# EAGLE design io (EAGLE 9.5.2)

## Sheet 1 of 5: Interface, Address Decoding
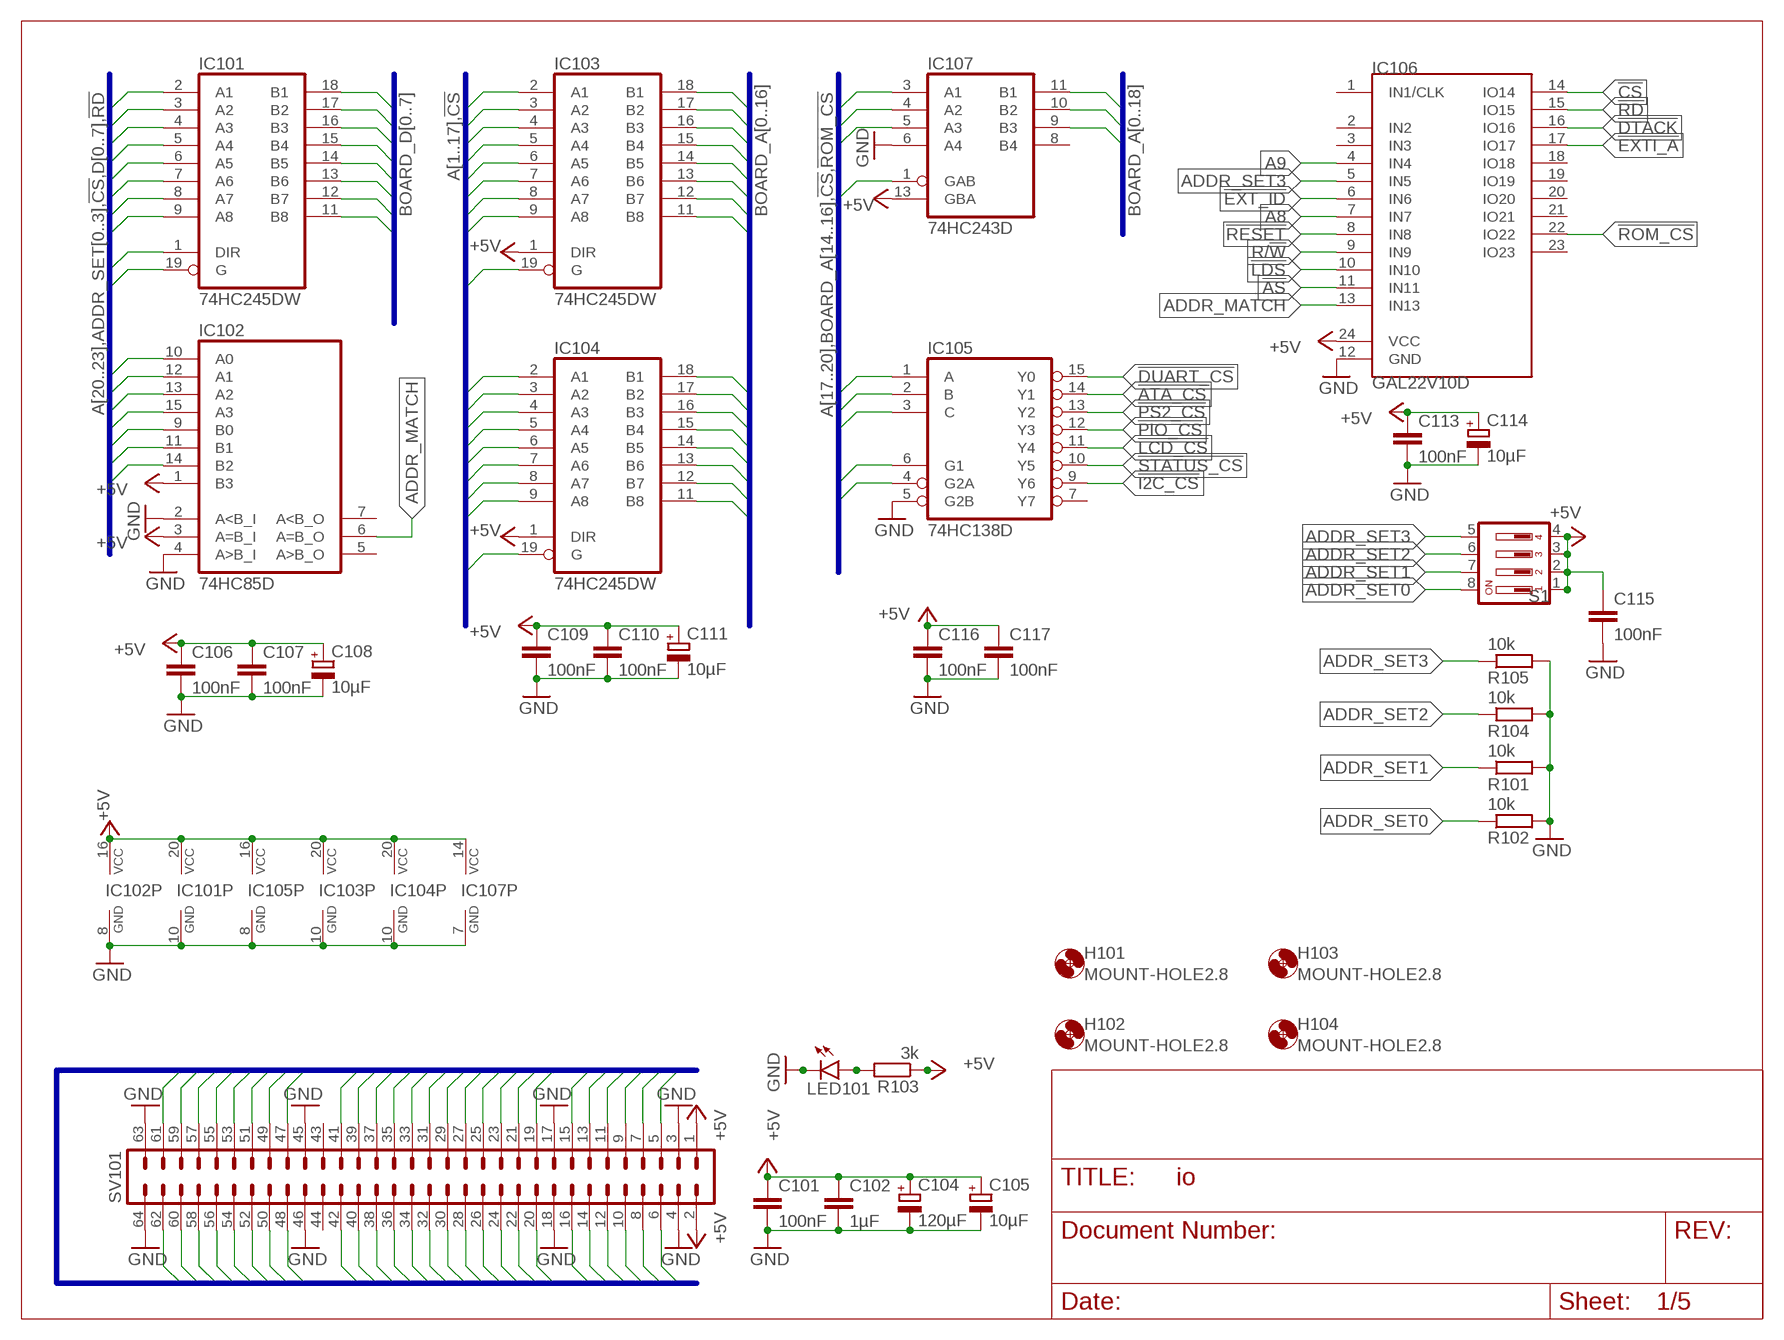
[diagram p0: schematic, sheet 1]

### Parts
C101  100nF  C-EUC0805  [C0805]
C102  1µF  C-EUC0805  [C0805]
C104  120µF  CPOL-EUE2.5-7  [E2,5-7]
C105  10µF  CPOL-EUSMCB  [SMC_B]
C106  100nF  C-EUC0805  [C0805]
C107  100nF  C-EUC0805  [C0805]
C108  10µF  CPOL-EUSMCB  [SMC_B]
C109  100nF  C-EUC0805  [C0805]
C110  100nF  C-EUC0805  [C0805]
C111  10µF  CPOL-EUSMCB  [SMC_B]
C113  100nF  C-EUC0805  [C0805]
C114  10µF  CPOL-EUSMCB  [SMC_B]
C115  100nF  C-EUC0805  [C0805]
C116  100nF  C-EUC0805  [C0805]
C117  100nF  C-EUC0805  [C0805]
H101  MOUNT-HOLE2.8  [2,8]
H102  MOUNT-HOLE2.8  [2,8]
H103  MOUNT-HOLE2.8  [2,8]
H104  MOUNT-HOLE2.8  [2,8]
IC101  74HC245DW  [SO20W]
IC102  74HC85D  [SO16]
IC103  74HC245DW  [SO20W]
IC104  74HC245DW  [SO20W]
IC105  74HC138D  [SO16]
IC106  GAL22V10D  GAL22V10DIP24  [DIL24S]
IC107  74HC243D  [SO14]
LED101  LEDCHIPLED_1206  [CHIPLED_1206]
R101  10k  R-EU_R2012  [R2012]
R102  10k  R-EU_R2012  [R2012]
R103  3k  R-EU_R2012  [R2012]
R104  10k  R-EU_R2012  [R2012]
R105  10k  R-EU_R2012  [R2012]
S1  DP04  [DP-04]
SV101  ML64L  [ML64L]

### Nets
!AS: IC106.11(IN11) SV101.13
!ATA_CS: IC105.14(Y1)
!BG: SV101.9
!BGACK: SV101.8
!BR: SV101.7
!CS: IC101.19(G) IC103.19(G) IC104.19(G) IC105.4(G2A) IC106.14(IO14) IC107.1(GAB)
!DTACK: IC106.16(IO16) SV101.10 ; also sheet 3
!DUART_CS: IC105.15(Y0) ; also sheet 3
!EXT_ID: IC106.6(IN6) SV101.41
!EXTI_A: IC106.17(IO17) SV101.16
!EXTI_B: SV101.15
!HALT: SV101.5
!I2C_CS: IC105.9(Y6)
!LCD_CS: IC105.11(Y4)
!LDS: IC106.10(IN10) SV101.11
!PIO_CS: IC105.12(Y3)
!PS2_CS: IC105.13(Y2) ; also sheet 5
!RD: IC101.1(DIR) IC106.15(IO15) ; also sheet 2,5
!RESET: IC106.8(IN8) SV101.6 ; also sheet 3
!ROM_CS: IC105.6(G1) IC106.22(IO22) ; also sheet 2
!STATUS_CS: IC105.10(Y5)
!UDS: SV101.14
+5V: C101.1 C102.1 C104.+ C105.+ C106.1 C107.1 C108.+ C109.1 C110.1 C111.+ C113.1 C114.+ C115.1 C116.1 C117.1 IC101.20(VCC) IC102.1(B3) IC102.3(A=B_I) IC102.16(VCC) IC103.1(DIR) IC103.20(VCC) IC104.1(DIR) IC104.20(VCC) IC105.16(VCC) IC106.24(VCC) IC107.13(GBA) IC107.14(VCC) R103.1 S1.1 S1.2 S1.3 S1.4 SV101.1 SV101.2 ; also sheet 2,3,5
A1: IC103.2(A1) SV101.20
A2: IC103.3(A2) SV101.22
A3: IC103.4(A3) SV101.19
A4: IC103.5(A4) SV101.24
A5: IC103.6(A5) SV101.21
A6: IC103.7(A6) SV101.23
A7: IC103.8(A7) SV101.26
A8: IC103.9(A8) IC106.7(IN7) SV101.25
A9: IC104.2(A1) IC106.4(IN4) SV101.28
A10: IC104.3(A2) SV101.27
A11: IC104.4(A3) SV101.30
A12: IC104.5(A4) SV101.29
A13: IC104.6(A5) SV101.31
A14: IC104.7(A6) SV101.32
A15: IC104.8(A7) SV101.33
A16: IC104.9(A8) SV101.34
A17: IC107.3(A1) SV101.36
A18: IC107.4(A2) SV101.35
A19: IC107.5(A3) SV101.38
A20: IC102.10(A0) SV101.37
A21: IC102.12(A1) SV101.40
A22: IC102.13(A2) SV101.39
A23: IC102.15(A3) SV101.42
ADDR_MATCH: IC102.6(A=B_O) IC106.13(IN13)
ADDR_SET0: IC102.9(B0) R102.1 S1.8
ADDR_SET1: IC102.11(B1) R101.1 S1.7
ADDR_SET2: IC102.14(B2) R104.1 S1.6
ADDR_SET3: IC106.5(IN5) R105.1 S1.5
BOARD_A0: IC103.18(B1) ; also sheet 2,3
BOARD_A1: IC103.17(B2) ; also sheet 2,3
BOARD_A2: IC103.16(B3) ; also sheet 2,3
BOARD_A3: IC103.15(B4) ; also sheet 2,3
BOARD_A4: IC103.14(B5) ; also sheet 2
BOARD_A5: IC103.13(B6) ; also sheet 2
BOARD_A6: IC103.12(B7) ; also sheet 2
BOARD_A7: IC103.11(B8) ; also sheet 2
BOARD_A8: IC104.18(B1) ; also sheet 2
BOARD_A9: IC104.17(B2) ; also sheet 2
BOARD_A10: IC104.16(B3) ; also sheet 2
BOARD_A11: IC104.15(B4) ; also sheet 2
BOARD_A12: IC104.14(B5) ; also sheet 2
BOARD_A13: IC104.13(B6) ; also sheet 2
BOARD_A14: IC104.12(B7) IC105.1(A) ; also sheet 2
BOARD_A15: IC104.11(B8) IC105.2(B) ; also sheet 2
BOARD_A16: IC105.3(C) IC107.11(B1)
BOARD_A17: IC107.10(B2)
BOARD_A18: IC107.9(B3)
BOARD_D0: IC101.18(B1) ; also sheet 3
BOARD_D1: IC101.17(B2) ; also sheet 3
BOARD_D2: IC101.16(B3) ; also sheet 3
BOARD_D3: IC101.15(B4) ; also sheet 3
BOARD_D4: IC101.14(B5) ; also sheet 3
BOARD_D5: IC101.13(B6) ; also sheet 3
BOARD_D6: IC101.12(B7) ; also sheet 3
BOARD_D7: IC101.11(B8) ; also sheet 3
D0: IC101.2(A1) SV101.62
D1: IC101.3(A2) SV101.60
D2: IC101.4(A3) SV101.58
D3: IC101.5(A4) SV101.56
D4: IC101.6(A5) SV101.54
D5: IC101.7(A6) SV101.52
D6: IC101.8(A7) SV101.50
D7: IC101.9(A8) SV101.48
D8: SV101.57
D9: SV101.59
D10: SV101.61
D11: SV101.55
D12: SV101.53
D13: SV101.51
D14: SV101.49
D15: SV101.47
GND: C101.2 C102.2 C104.- C105.- C106.2 C107.2 C108.- C109.2 C110.2 C111.- C113.2 C114.- C115.2 C116.2 C117.2 IC101.10(GND) IC102.2(A<B_I) IC102.4(A>B_I) IC102.8(GND) IC103.10(GND) IC104.10(GND) IC105.5(G2B) IC105.8(GND) IC106.12(GND) IC107.6(A4) IC107.7(GND) LED101.C R101.2 R102.2 R104.2 R105.2 SV101.3 SV101.4 SV101.17 SV101.18 SV101.45 SV101.46 SV101.63 SV101.64 ; also sheet 2,3,5
N$18: LED101.A R103.2
R/!W!: IC106.9(IN9) SV101.12 ; also sheet 2,5
Unconnected: IC102.5(A>B_O) IC102.7(A<B_O) IC105.7(Y7) IC106.1(IN1/CLK) IC106.2(IN2) IC106.3(IN3) IC106.18(IO18) IC106.19(IO19) IC106.20(IO20) IC106.21(IO21) IC106.23(IO23) IC107.8(B4) SV101.43 SV101.44

### Buses
A[1..23],!BERR,!BG,!BGACK,!BR,CLK,D[0..15],!DTACK,E,!EXTI_A,!EXTI_B,!EXT_ID,FC[0..2],!HALT,!IPL[0..2],!RESET,R/!W!,!VMA,!VPA
A[20..23],ADDR_SET[0..3],!CS,D[0..7],!RD
BOARD_A[0..18]
A[17..20],BOARD_A[14..16],!CS,!ROM_CS
BOARD_D[0..7]
A[1..17],!CS
BOARD_A[0..16]

## Sheet 2 of 5: Card ID
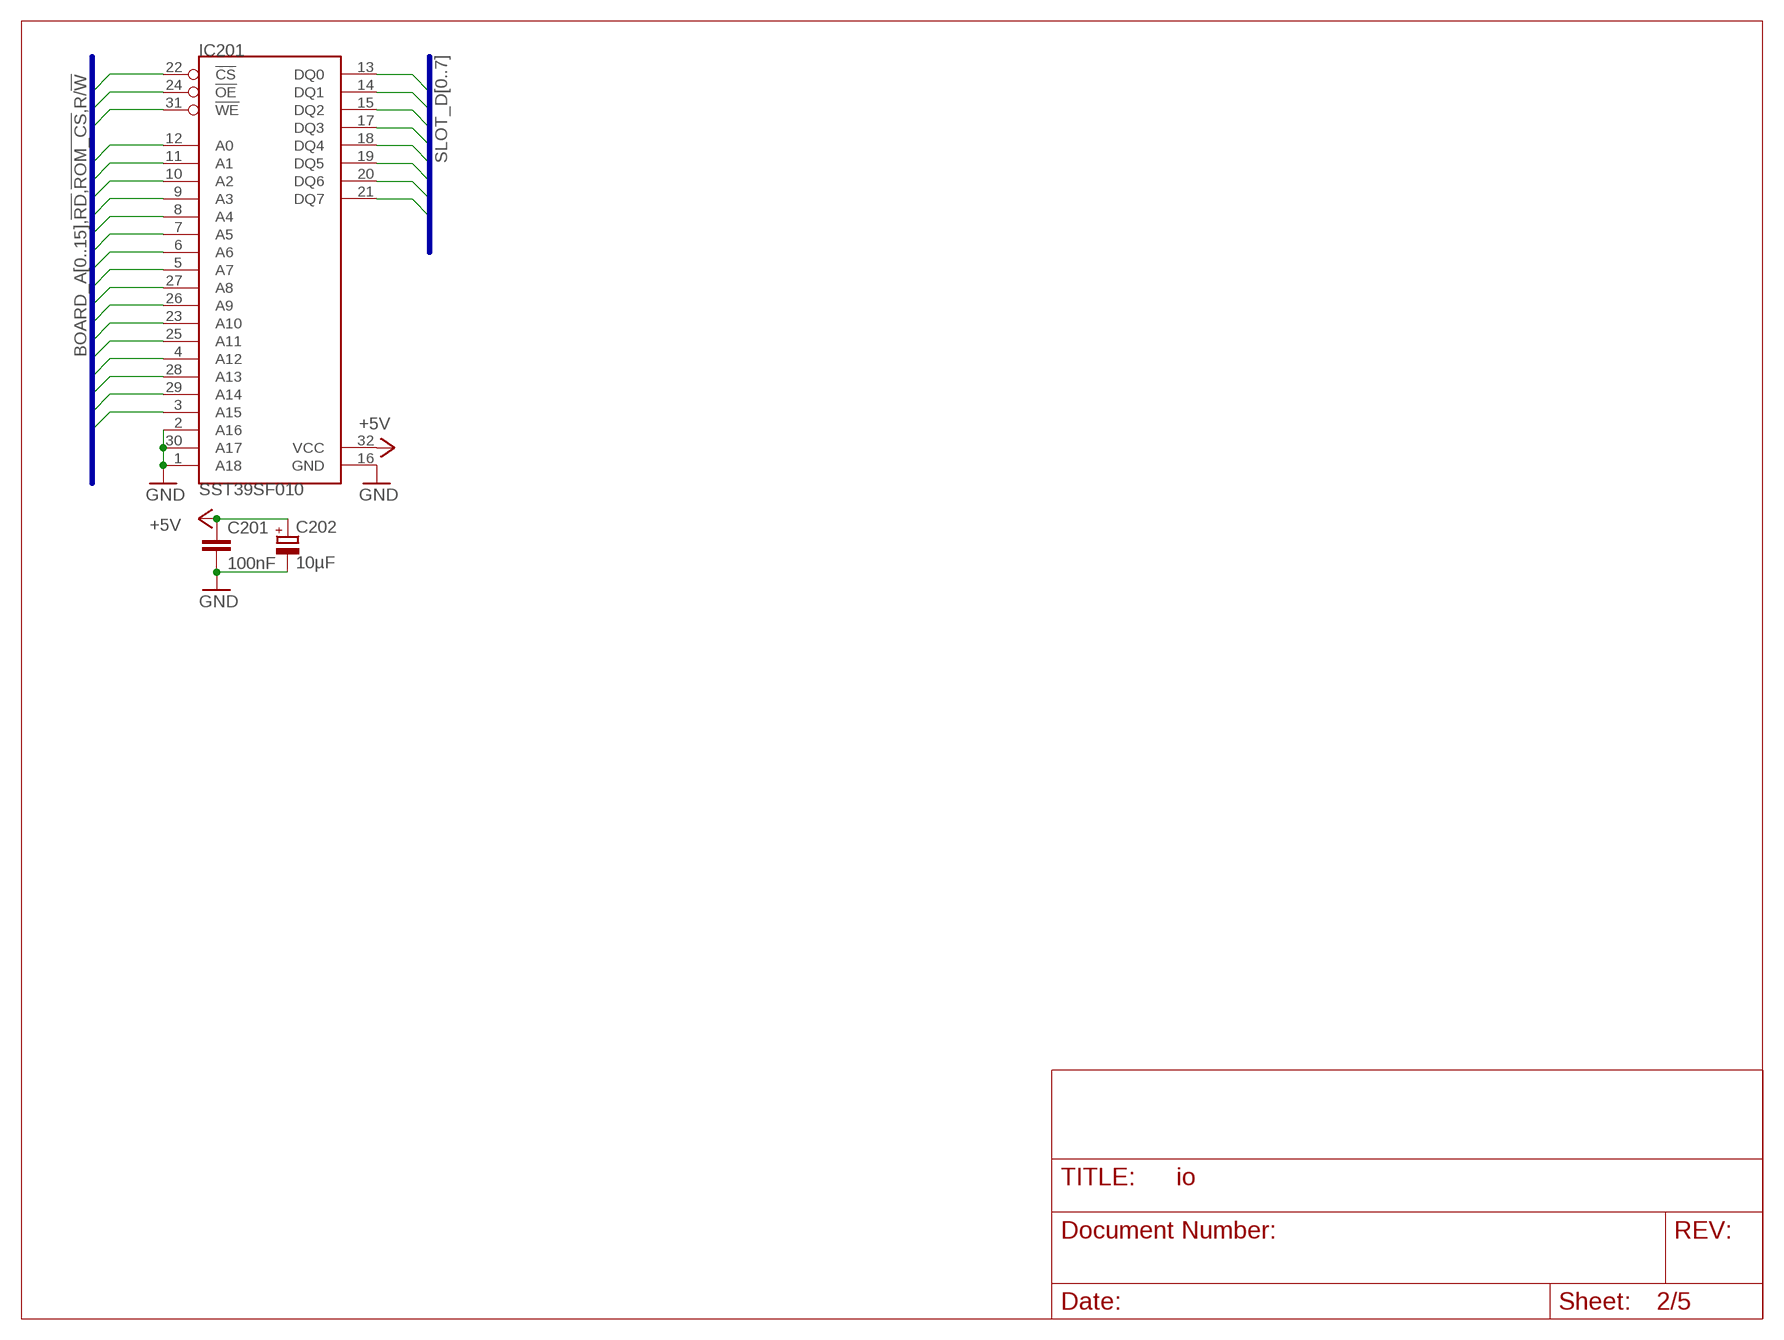
[diagram p1: schematic, sheet 2]

### Parts
C201  100nF  C-EUC0805  [C0805]
C202  10µF  CPOL-EUSMCB  [SMC_B]
IC201  SST39SF010  SST39SF0X0PLCC32-SOCKET  [PLCC-S32]

### Nets
!RD: IC201.24(!OE) ; also sheet 1,5
!ROM_CS: IC201.22(!CS) ; also sheet 1
+5V: C201.1 C202.+ IC201.32(VCC) ; also sheet 1,3,5
BOARD_A0: IC201.12(A0) ; also sheet 1,3
BOARD_A1: IC201.11(A1) ; also sheet 1,3
BOARD_A2: IC201.10(A2) ; also sheet 1,3
BOARD_A3: IC201.9(A3) ; also sheet 1,3
BOARD_A4: IC201.8(A4) ; also sheet 1
BOARD_A5: IC201.7(A5) ; also sheet 1
BOARD_A6: IC201.6(A6) ; also sheet 1
BOARD_A7: IC201.5(A7) ; also sheet 1
BOARD_A8: IC201.27(A8) ; also sheet 1
BOARD_A9: IC201.26(A9) ; also sheet 1
BOARD_A10: IC201.23(A10) ; also sheet 1
BOARD_A11: IC201.25(A11) ; also sheet 1
BOARD_A12: IC201.4(A12) ; also sheet 1
BOARD_A13: IC201.28(A13) ; also sheet 1
BOARD_A14: IC201.29(A14) ; also sheet 1
BOARD_A15: IC201.3(A15) ; also sheet 1
GND: C201.2 C202.- IC201.1(A18) IC201.2(A16) IC201.16(GND) IC201.30(A17) ; also sheet 1,3,5
R/!W!: IC201.31(!WE) ; also sheet 1,5
SLOT_D0: IC201.13(DQ0) ; also sheet 5
SLOT_D1: IC201.14(DQ1) ; also sheet 5
SLOT_D2: IC201.15(DQ2) ; also sheet 5
SLOT_D3: IC201.17(DQ3) ; also sheet 5
SLOT_D4: IC201.18(DQ4) ; also sheet 5
SLOT_D5: IC201.19(DQ5) ; also sheet 5
SLOT_D6: IC201.20(DQ6) ; also sheet 5
SLOT_D7: IC201.21(DQ7) ; also sheet 5

### Buses
SLOT_D[0..7]
BOARD_A[0..15],!RD,!ROM_CS,R/!W!

## Sheet 3 of 5: Serial/Parallel IO
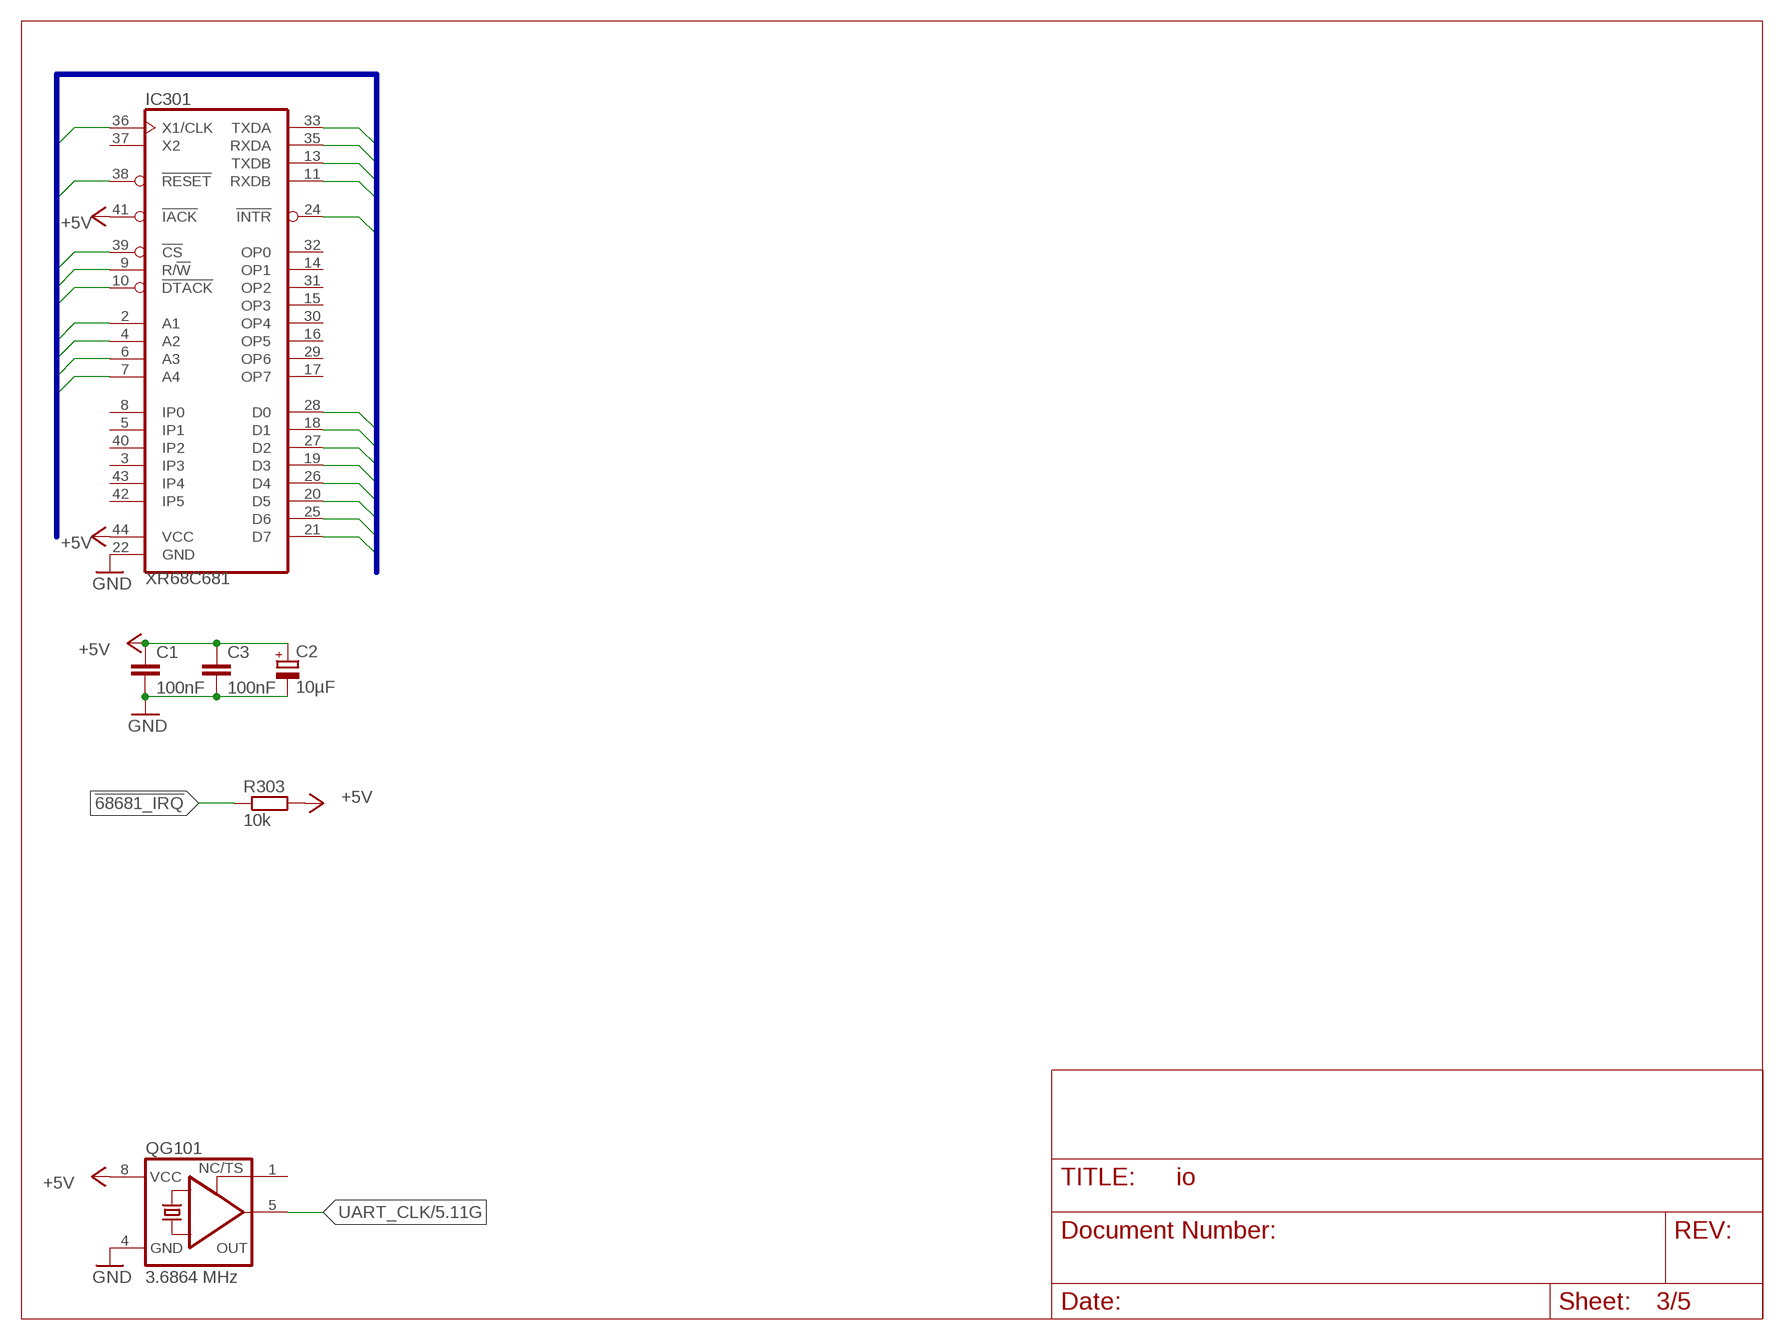
[diagram p2: schematic, sheet 3]

### Parts
C1  100nF  C-EUC0805  [C0805]
C2  10µF  CPOL-EUSMCB  [SMC_B]
C3  100nF  C-EUC0805  [C0805]
IC301  XR68C681  MC68681PLCC44-SOCKET  [PLCC-S44]
QG101  3.6864 MHz  XO-8  [DIL08S]
R303  10k  R-EU_R2012  [R2012]

### Nets
!68681_IRQ: IC301.24(!INTR) R303.1
!DTACK: IC301.10(!DTACK) ; also sheet 1
!DUART_CS: IC301.39(!CS) ; also sheet 1
!LWE: IC301.9(R/!W)
!RESET: IC301.38(!RESET) ; also sheet 1
+5V: C1.1 C2.+ C3.1 IC301.41(!IACK) IC301.44(VCC) QG101.8(VCC) R303.2 ; also sheet 1,2,5
A_RX: IC301.35(RXDA)
A_TX: IC301.33(TXDA)
B_RX: IC301.11(RXDB)
B_TX: IC301.13(TXDB)
BOARD_A0: IC301.2(A1) ; also sheet 1,2
BOARD_A1: IC301.4(A2) ; also sheet 1,2
BOARD_A2: IC301.6(A3) ; also sheet 1,2
BOARD_A3: IC301.7(A4) ; also sheet 1,2
BOARD_D0: IC301.28(D0) ; also sheet 1
BOARD_D1: IC301.18(D1) ; also sheet 1
BOARD_D2: IC301.27(D2) ; also sheet 1
BOARD_D3: IC301.19(D3) ; also sheet 1
BOARD_D4: IC301.26(D4) ; also sheet 1
BOARD_D5: IC301.20(D5) ; also sheet 1
BOARD_D6: IC301.25(D6) ; also sheet 1
BOARD_D7: IC301.21(D7) ; also sheet 1
GND: C1.2 C2.- C3.2 IC301.22(GND) QG101.4(GND) ; also sheet 1,2,5
UART_CLK: IC301.36(X1/CLK) QG101.5(OUT) ; also sheet 5
Unconnected: IC301.3(IP3) IC301.5(IP1) IC301.8(IP0) IC301.14(OP1) IC301.15(OP3) IC301.16(OP5) IC301.17(OP7) IC301.29(OP6) IC301.30(OP4) IC301.31(OP2) IC301.32(OP0) IC301.37(X2) IC301.40(IP2) IC301.42(IP5) IC301.43(IP4) QG101.1(TS)

### Buses
!68681_IRQ,A_RX,A_TX,BOARD_A[0..4],BOARD_D[0..7],B_RX,B_TX,!DTACK,!DUART_CS,!LWE,!RESET,UART_CLK

## Sheet 4 of 5: IDE Interface
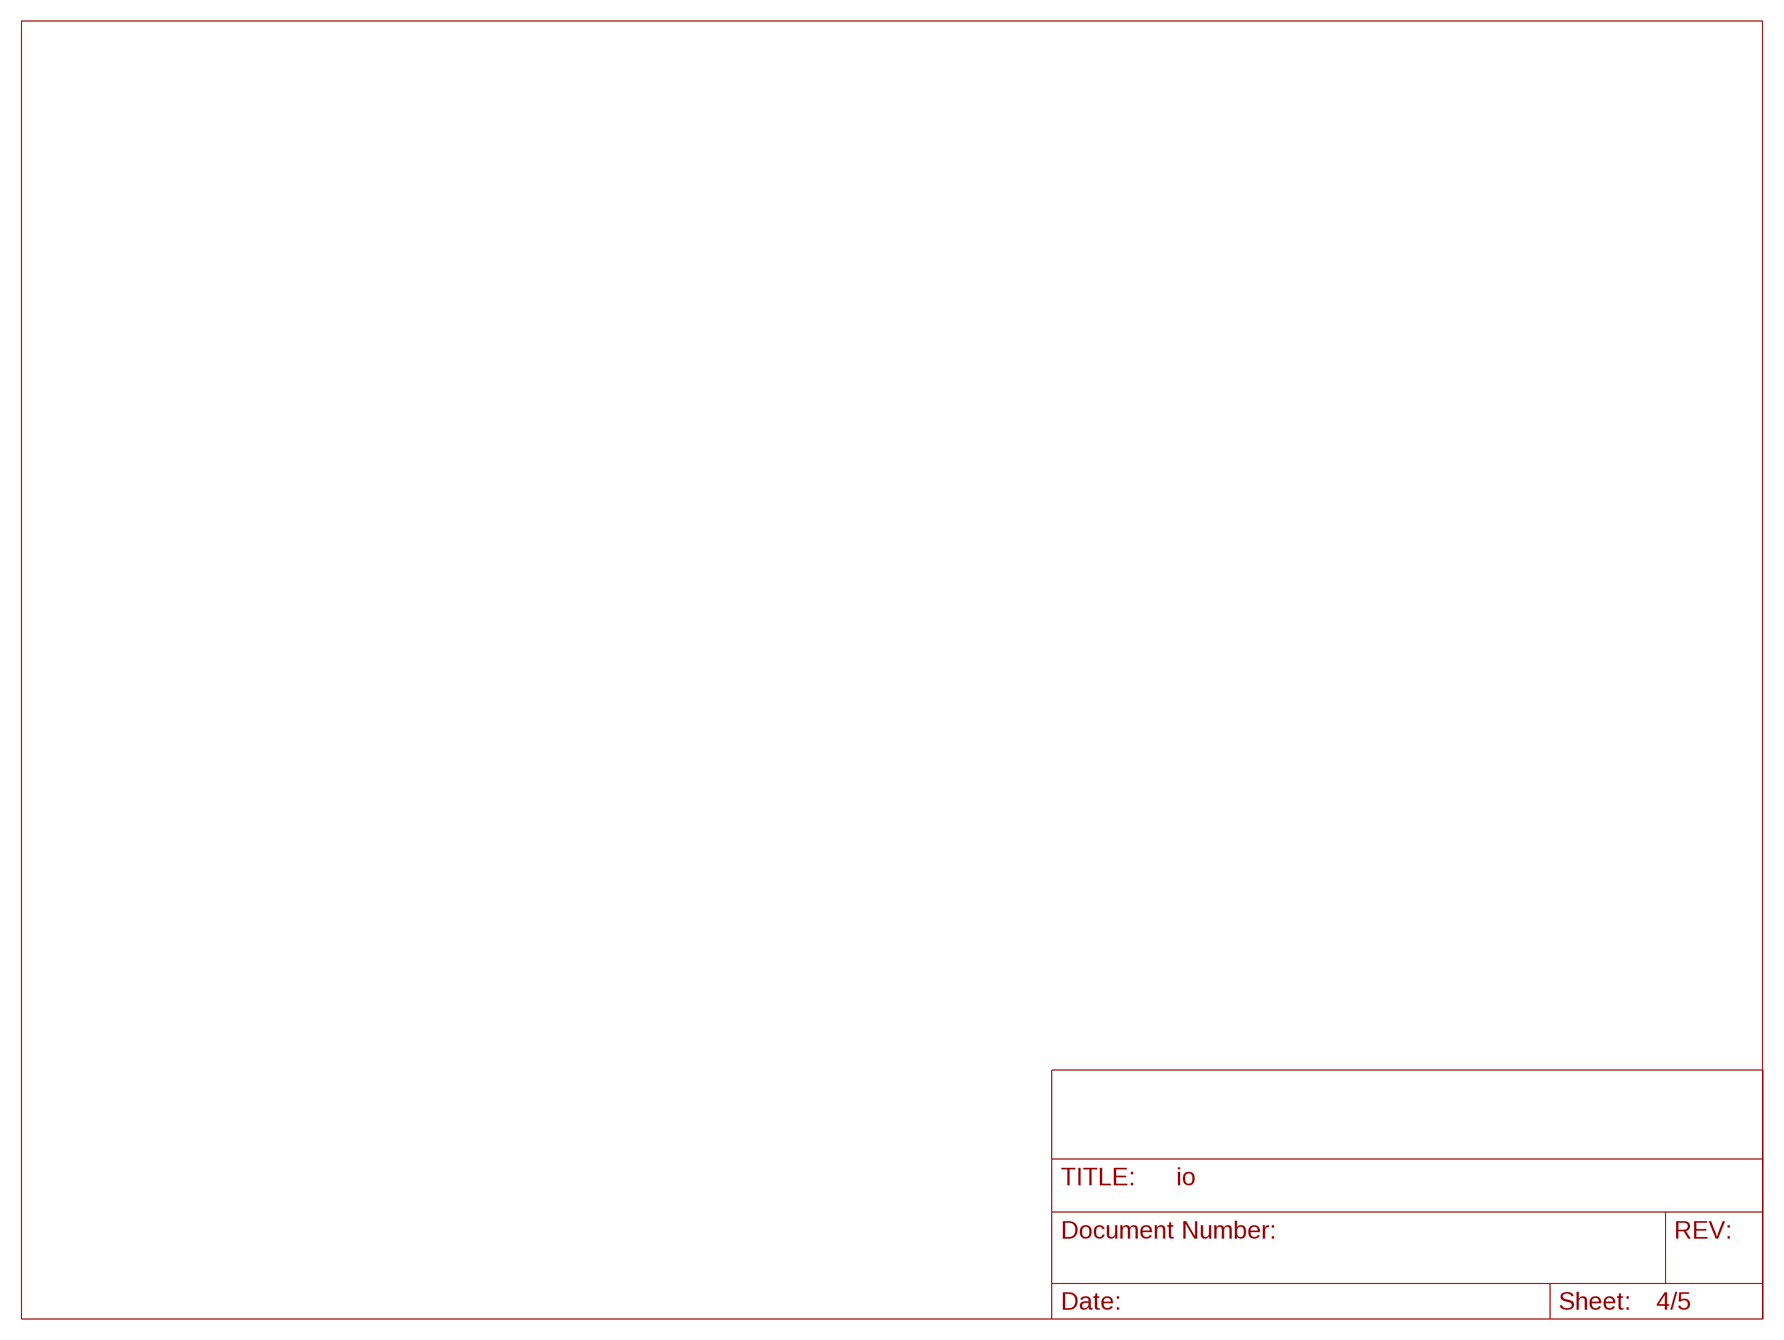
[diagram p3: schematic, sheet 4]

## Sheet 5 of 5: PS/2 Keyboard/Mouse
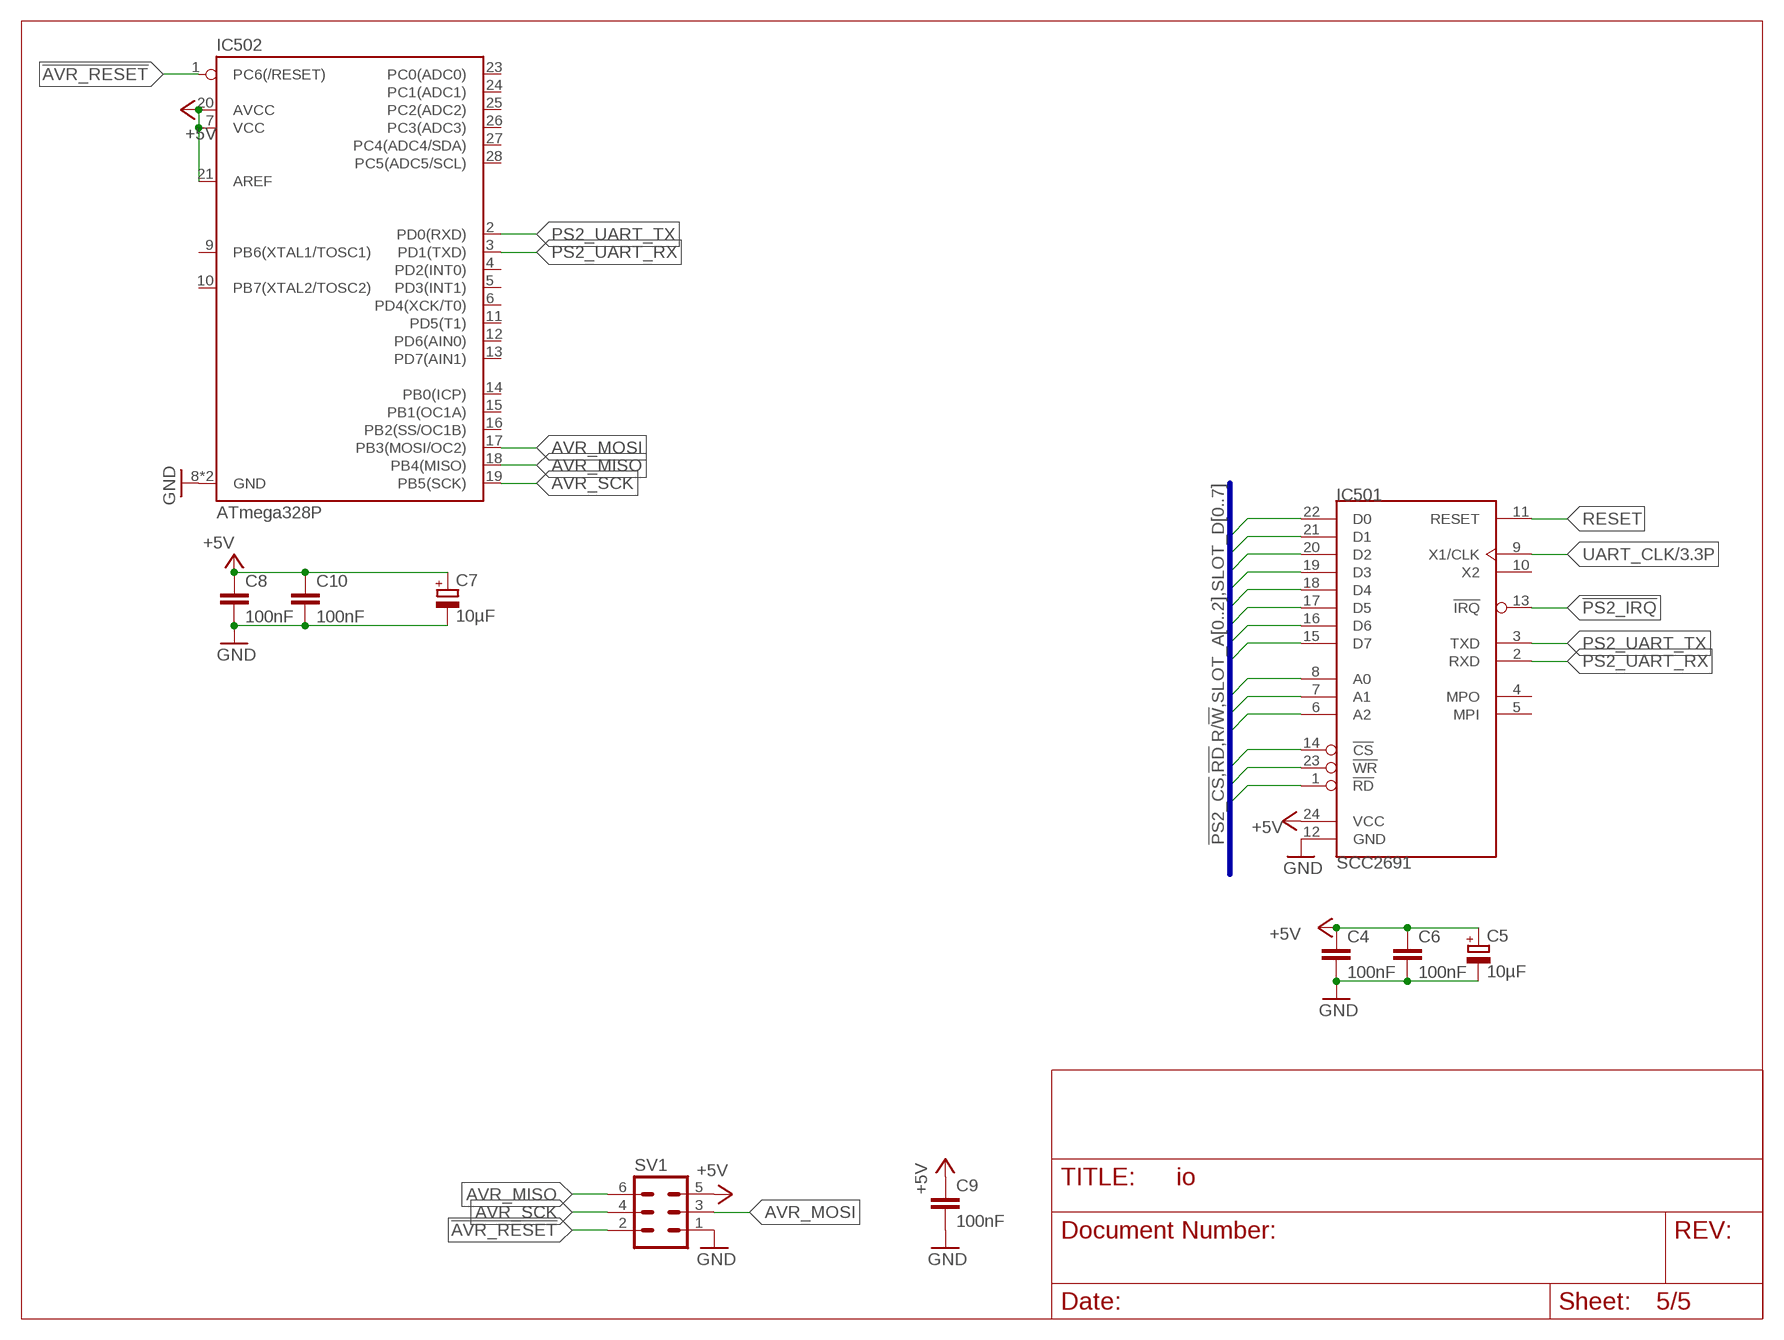
[diagram p4: schematic, sheet 5]

### Parts
C4  100nF  C-EUC0805  [C0805]
C5  10µF  CPOL-EUSMCB  [SMC_B]
C6  100nF  C-EUC0805  [C0805]
C7  10µF  CPOL-EUSMCB  [SMC_B]
C8  100nF  C-EUC0805  [C0805]
C9  100nF  C-EUC0805  [C0805]
C10  100nF  C-EUC0805  [C0805]
IC501  SCC2691  [DIL24S]
IC502  ATmega328P  ATMEGA328P_PDIP  [DIP28]
SV1  ML6  [ML6]

### Nets
!AVR_RESET: IC502.1(PC6(/RESET)) SV1.2
!PS2_CS: IC501.14(!CS) ; also sheet 1
!PS2_IRQ: IC501.13(!IRQ)
!RD: IC501.1(!RD) ; also sheet 1,2
+5V: C4.1 C5.+ C6.1 C7.+ C8.1 C9.1 C10.1 IC501.24(VCC) IC502.7(VCC) IC502.20(AVCC) IC502.21(AREF) SV1.5 ; also sheet 1,2,3
AVR_MISO: IC502.18(PB4(MISO)) SV1.6
AVR_MOSI: IC502.17(PB3(MOSI/OC2)) SV1.3
AVR_SCK: IC502.19(PB5(SCK)) SV1.4
GND: C4.2 C5.- C6.2 C7.- C8.2 C9.2 C10.2 IC501.12(GND) IC502.8(GND) IC502.22(GND) SV1.1 ; also sheet 1,2,3
PS2_UART_RX: IC501.2(RXD) IC502.3(PD1(TXD))
PS2_UART_TX: IC501.3(TXD) IC502.2(PD0(RXD))
R/!W!: IC501.23(!WR) ; also sheet 1,2
RESET: IC501.11(RESET)
SLOT_A0: IC501.8(A0)
SLOT_A1: IC501.7(A1)
SLOT_A2: IC501.6(A2)
SLOT_D0: IC501.22(D0) ; also sheet 2
SLOT_D1: IC501.21(D1) ; also sheet 2
SLOT_D2: IC501.20(D2) ; also sheet 2
SLOT_D3: IC501.19(D3) ; also sheet 2
SLOT_D4: IC501.18(D4) ; also sheet 2
SLOT_D5: IC501.17(D5) ; also sheet 2
SLOT_D6: IC501.16(D6) ; also sheet 2
SLOT_D7: IC501.15(D7) ; also sheet 2
UART_CLK: IC501.9(X1/CLK) ; also sheet 3
Unconnected: IC501.4(MPO) IC501.5(MPI) IC501.10(X2) IC502.4(PD2(INT0)) IC502.5(PD3(INT1)) IC502.6(PD4(XCK/T0)) IC502.9(PB6(XTAL1/TOSC1)) IC502.10(PB7(XTAL2/TOSC2)) IC502.11(PD5(T1)) IC502.12(PD6(AIN0)) IC502.13(PD7(AIN1)) IC502.14(PB0(ICP)) IC502.15(PB1(OC1A)) IC502.16(PB2(SS/OC1B)) IC502.23(PC0(ADC0)) IC502.24(PC1(ADC1)) IC502.25(PC2(ADC2)) IC502.26(PC3(ADC3)) IC502.27(PC4(ADC4/SDA)) IC502.28(PC5(ADC5/SCL))

### Buses
!PS2_CS,!RD,R/!W!,SLOT_A[0..2],SLOT_D[0..7]

## Library data of the parts
C1 C3 C4 C6 C8-C10 C101 C106 C107 C109 C110 C113 C115-C117 C201 = rcl:C-EU: CAPACITOR, European symbol; MOUSER: 710-885012207072; SPICEPREFIX: C
C2 C5 C7 C105 C108 C111 C114 C202 = rcl:CPOL-EU: POLARIZED CAPACITOR, European symbol; MOUSER: 581-TAJB106K020RNJV; SPICEPREFIX: C
C102 = rcl:C-EU: CAPACITOR, European symbol; MOUSER: 710-885012207078; SPICEPREFIX: C
C104 = rcl:CPOL-EU: POLARIZED CAPACITOR, European symbol; MOUSER: 710-860020373007; SPICEPREFIX: C
H101-H104 = holes:MOUNT-HOLE: MOUNTING HOLE with drill center marker
IC101 IC103 IC104 = 74xx-eu:74*245: Octal BUS TRANSCEIVER, 3-state; MOUSER: 595-SN74HC245DWR
IC102 = 74xx-eu:74*85: 4-bit magnitude COMPARATOR; MOUSER: 771-74HC138D
IC105 = 74xx-eu:74*138: 3-line to 8-line DECODER/DEMULTIPLEXER; MOUSER: 771-74HC138D
IC106 = 68komputer:GAL22V10: GAL22V10D – Generic Array Logic Datasheet <http://web.mit.edu/6.115/www/document/gal22v10.pdf>; MOUSER_SOCKET: 575-1104732441001000
IC107 = 74xx-eu:74*243: Quadruple BUS TRANSCEIVER; MOUSER: 595-CD74HC243M96
IC201 = 68komputer:SST39SF0X0: 1 Mbit / 2 Mbit / 4 Mbit Multi-Purpose Flash Datasheet <http://ww1.microchip.com/downloads/en/DeviceDoc/20005022C.pdf>; MOUSER: 579-SST3910A554INHET; MOUSER_SOCKET: 437-5408803224008
IC301 = 68komputer:MC68681: MC68681 Dual UART Datasheet <https://www.nxp.com/docs/en/data-sheet/SCC68681.pdf>; MOUSER: 701-XR68C681CJ-F; MOUSER_SOCKET: 940-44-044-24-000000
IC501 = 68komputer:SCC2691: SCC2691 – Universal asynchronous receiver/transmitter (UART) Datasheet <https://www.nxp.com/docs/en/data-sheet/SCC2691.pdf>; MOUSER_SOCKET: 575-1104732441001000
IC502 = SparkFun-IC-Microcontroller:ATMEGA328P_PDIP: Atmel 328P Through hole ATMEGA328P uC used in the Arduino 32kb flash, 1k EEPROM, 2k SRAM Datasheet <http://www.sparkfun.com/datasheets/Components/SMD/ATMega328.pdf> SparkFun Products Storefront component: AVR 28 Pin 20MHz 32K 6A/D - ATMega328P <https://www.sparkfun.com/products/9061> (COM-09061) SparkFun Simon Says - Through-Hole Soldering Kit <https://www.sparkfun.com/products/10547> (KIT-10547) SparkFun Learn to Solder - Simon Says <https://www.sparkfun.com/products/13708> (KIT-13708) SparkFun BigTime Watch Kit <https://www.sparkfun.com/products/11734> (KIT-11734) SparkFun ClockIt <https://www.sparkfun.com/products/10930> (KIT-10930) SparkFun Serial Enabled LCD Kit <https://www.sparkfun.com/products/10097> (LCD-10097) SparkFun Simon Tilts - Through Hole Soldering Kit <https://www.sparkfun.com/products/12634> (KIT-12634) SparkFun Frequency Counter Kit <https://www.sparkfun.com/products/10140> (KIT-10140) FabFM Radio Kit <https://www.sparkfun.com/products/11043> (KIT-11043) SparkFun Binary Blaster Kit <https://www.sparkfun.com/products/12037> (KIT-12037) SparkFun Metro-Gnome <https://www.sparkfun.com/products/9236> (KIT-09236) ATmega328 with Arduino Optiboot (Uno) <https://www.sparkfun.com/products/10524> (DEV-10524); MOUSER: 556-ATMEGA328-PU; PROD_ID: IC-09136; VALUE: 328P
LED101 = led:LED: LED OSRAM: - CHIPLED LG R971, LG N971, LY N971, LG Q971, LY Q971, LO R971, LY R971 LH N974, LH R974 LS Q976, LO Q976, LY Q976 LO Q996 - Hyper CHIPLED LW Q18S LB Q993, LB Q99A, LB R99A - SideLED LS A670, LO A670, LY A670, LG A670, LP A670 LB A673, LV A673, LT A673, LW A673 LH A674 LY A675 LS A676, LA A676, LO A676, LY A676, LW A676 LS A679, LY A679, LG A679 - Hyper Micro SIDELED® LS Y876, LA Y876, LO Y876, LY Y876 LT Y87S - SmartLED LW L88C, LW L88S LB L89C, LB L89S, LG L890 LS L89K, LO L89K, LY L89K LS L896, LA L896, LO L896, LY L896 - TOPLED LS T670, LO T670, LY T670, LG T670, LP T670 LSG T670, LSP T670, LSY T670, LOP T670, LYG T670 LG T671, LOG T671, LSG T671 LB T673, LV T673, LT T673, LW T673 LH T674 LS T676, LA T676, LO T676, LY T676, LB T676, LH T676, LSB T676, LW T676 LB T67C, LV T67C, LT T67C, LS T67K, LO T67K, LY T67K, LW E67C LS E67B, LA E67B, LO E67B, LY E67B, LB E67C, LV E67C, LT E67C LW T67C LS T679, LY T679, LG T679 LS T770, LO T770, LY T770, LG T770, LP T770 LB T773, LV T773, LT T773, LW T773 LH T774 LS E675, LA E675, LY E675, LS T675 LS T776, LA T776, LO T776, LY T776, LB T776 LHGB T686 LT T68C, LB T68C - Hyper Mini TOPLED® LB M676 - Mini TOPLED Santana® LG M470 LS M47K, LO M47K, LY M47K Source: http://www.osram.convergy.de LUXEON: - LUMILED® LXK2-PW12-R00, LXK2-PW12-S00, LXK2-PW14-U00, LXK2-PW14-V00 LXK2-PM12-R00, LXK2-PM12-S00, LXK2-PM14-U00 LXK2-PE12-Q00, LXK2-PE12-R00, LXK2-PE12-S00, LXK2-PE14-T00, LXK2-PE14-U00 LXK2-PB12-K00, LXK2-PB12-L00, LXK2-PB12-M00, LXK2-PB14-N00, LXK2-PB14-P00, LXK2-PB14-Q00 LXK2-PR12-L00, LXK2-PR12-M00, LXK2-PR14-Q00, LXK2-PR14-R00 LXK2-PD12-Q00, LXK2-PD12-R00, LXK2-PD12-S00 LXK2-PH12-R00, LXK2-PH12-S00 LXK2-PL12-P00, LXK2-PL12-Q00, LXK2-PL12-R00 Source: www.luxeon.com KINGBRIGHT: KA-3528ASYC Source: www.kingbright.com; MOUSER: 710-156120YS75300
QG101 = crystal:XO-: CRYSTAL; MOUSER: 774-MXO45HS-3C-3.6; MOUSER_SOCKET: 535-1108800; OC_FARNELL: unknown; OC_NEWARK: unknown
R101 R102 R104 R105 R303 = rcl:R-EU_: RESISTOR, European symbol; MOUSER: 652-CR0805FX-1002ELF; SPICEPREFIX: R
R103 = rcl:R-EU_: RESISTOR, European symbol; MOUSER: 652-CR0805JW-302ELF; SPICEPREFIX: R
S1 = switch-dil:DP04: DIL/CODE SWITCH; MOUSER: 653-A6FR-2104; MPN: DP04; OC_FARNELL: 9471600; OC_NEWARK: 73J0027
SV1 = con-harting-ml:ML6: HARTING; OC_FARNELL: unknown; OC_NEWARK: unknown
SV101 = con-harting-ml:ML64: HARTING; OC_FARNELL: unknown; OC_NEWARK: unknown

## Net classes
0 default: width 0.203 mm

## Board
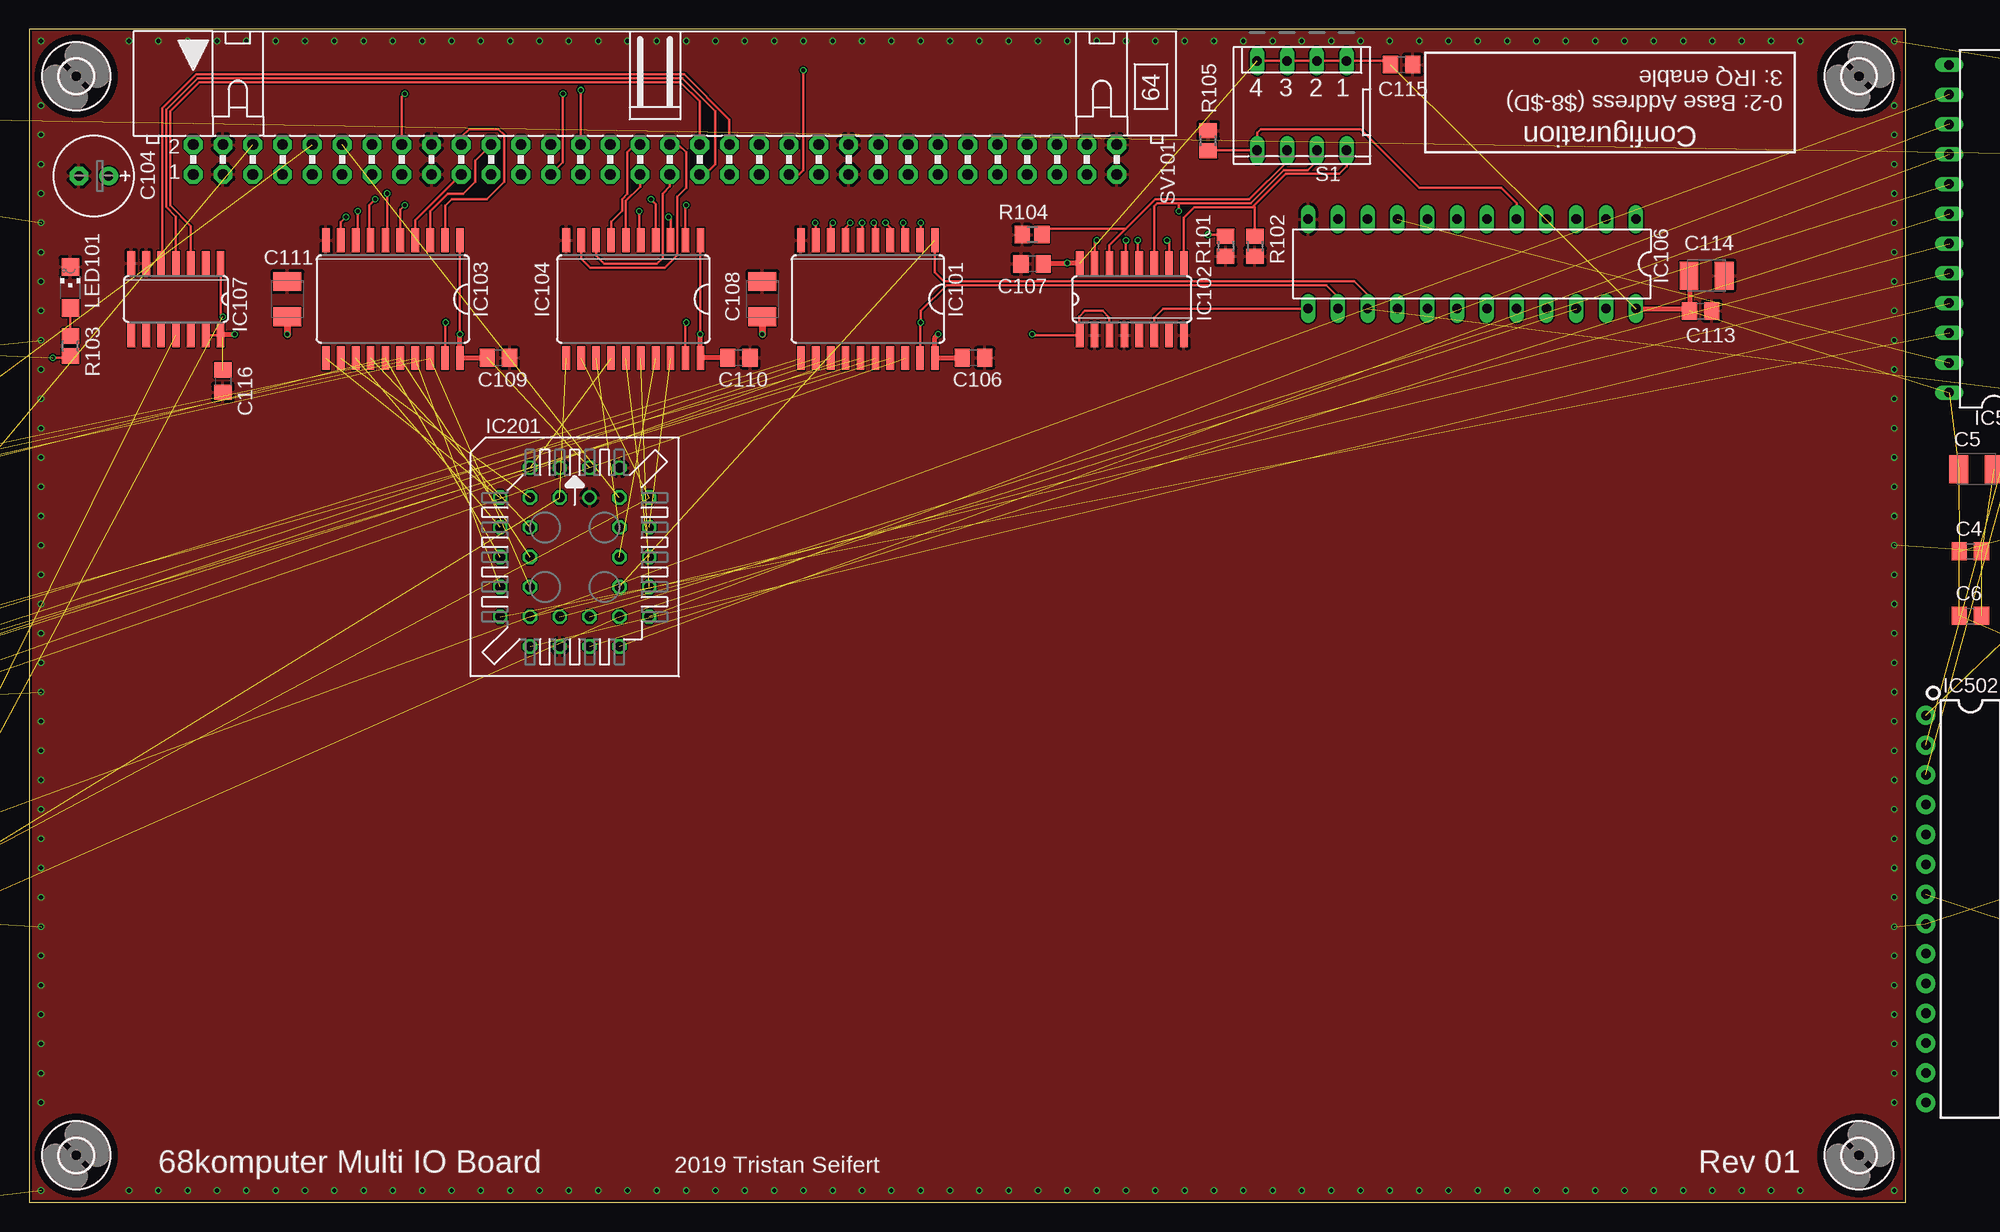
[diagram p5: board, top side]
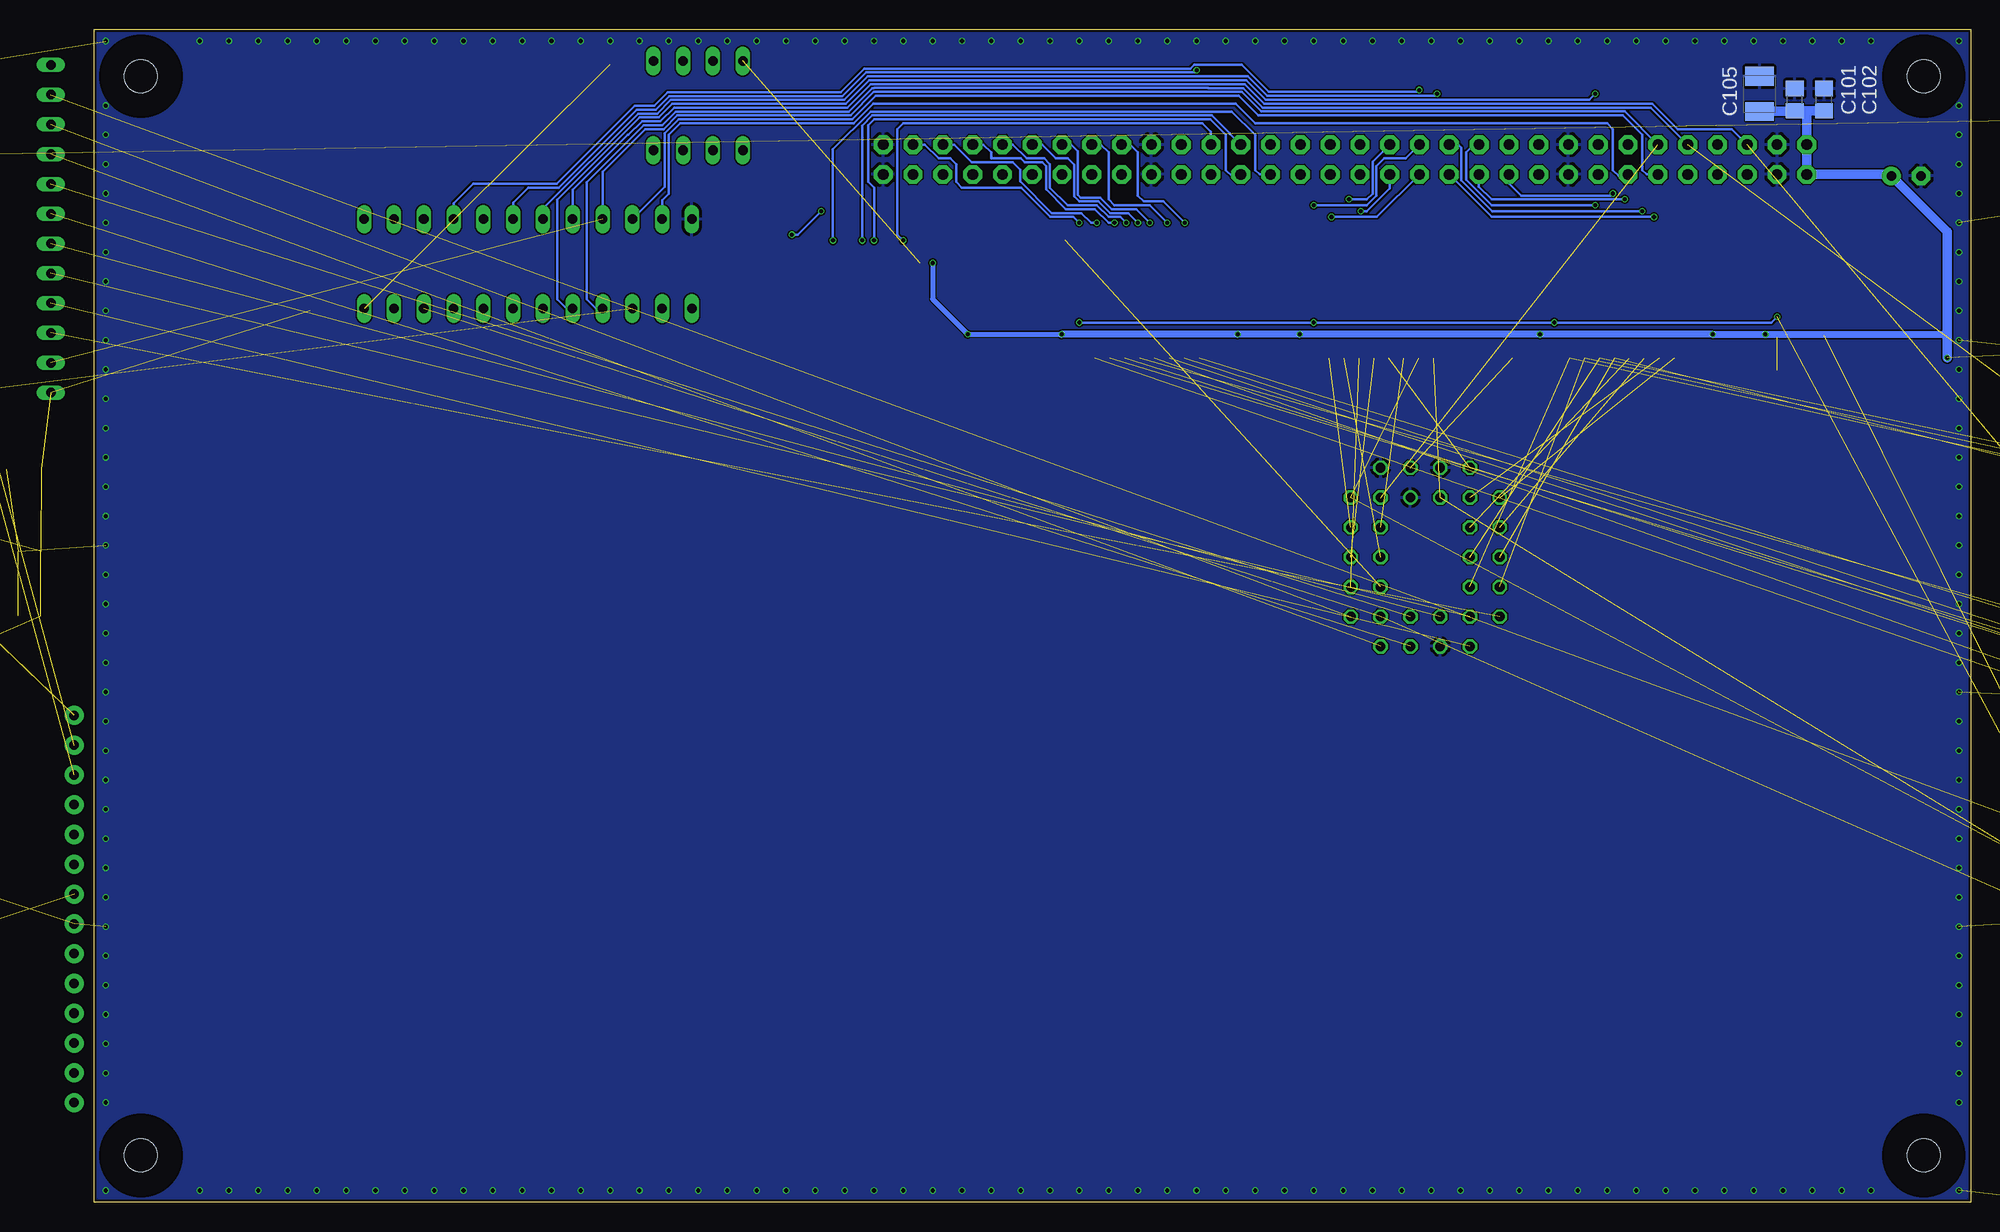
[diagram p6: board, bottom side, seen from below]

Size 160 x 100 mm. Coordinates in mm from the lower left corner, seen from the top.
Outline: 0,0 160,0 160,100 0,100 0,0
Copper layers (1*16): Top 0.035559375mm / dielectric 1.6mm / Bottom 0.035559375mm
Design rules "jlcpcb2layer": minimum track width 5mil, minimum drill 12mil, track to track 5mil, track to pad 5mil, pad to pad 5mil, via to via 5mil, smd to smd 5mil, copper to edge 8mil, drill to drill 6mil, minimum pad ring 5mil, minimum via ring 3mil, stop-mask expansion 2.5mil, vias tented up to drill 0mil, thermal gap 10mil

### Footprints (pad centres in the part's own frame; a part is rotated, then mirrored left to right if it is on the bottom)
C0805 = smd 1.3 x 1.5: 1 -0.95,0; 2 0.95,0
SMC_B = smd 1.6 x 2.4: + -1.5,0; - 1.5,0
E2,5-7 = drill 0.813 pad 1.6: + -1.27,0 | drill 0.813 pad 1.6 octagon: - 1.27,0
2,8 = hole 2.8: 0,0
SO20W = smd 0.66 x 2.032: 1 -5.715,-5.029; 2 -4.445,-5.029; 3 -3.175,-5.029; 4 -1.905,-5.029; 5 -0.635,-5.029; 6 0.635,-5.029; 7 1.905,-5.029; 8 3.175,-5.029; 9 4.445,-5.029; 10 5.715,-5.029; 11 5.715,5.029; 12 4.445,5.029; 13 3.175,5.029; 14 1.905,5.029; 15 0.635,5.029; 16 -0.635,5.029; 17 -1.905,5.029; 18 -3.175,5.029; 19 -4.445,5.029; 20 -5.715,5.029
SO16 = smd 0.66 x 2.032: 1 -4.445,-3.073; 2 -3.175,-3.073; 3 -1.905,-3.073; 4 -0.635,-3.073; 5 0.635,-3.073; 6 1.905,-3.073; 7 3.175,-3.073; 8 4.445,-3.073; 9 4.445,3.073; 10 3.175,3.073; 11 1.905,3.073; 12 0.635,3.073; 13 -0.635,3.073; 14 -1.905,3.073; 15 -3.175,3.073; 16 -4.445,3.073
DIL24S = drill 0.813 long: 1 -13.97,-3.81; 2 -11.43,-3.81; 3 -8.89,-3.81; 4 -6.35,-3.81; 5 -3.81,-3.81; 6 -1.27,-3.81; 7 1.27,-3.81; 8 3.81,-3.81; 9 6.35,-3.81; 10 8.89,-3.81; 11 11.43,-3.81; 12 13.97,-3.81; 13 13.97,3.81; 14 11.43,3.81; 15 8.89,3.81; 16 6.35,3.81; 17 3.81,3.81; 18 1.27,3.81; 19 -1.27,3.81; 20 -3.81,3.81; 21 -6.35,3.81; 22 -8.89,3.81; 23 -11.43,3.81; 24 -13.97,3.81
SO14 = smd 0.66 x 2.032: 1 -3.81,-3.073; 2 -2.54,-3.073; 3 -1.27,-3.073; 4 0,-3.073; 5 1.27,-3.073; 6 2.54,-3.073; 7 3.81,-3.073; 8 3.81,3.073; 9 2.54,3.073; 10 1.27,3.073; 11 0,3.073; 12 -1.27,3.073; 13 -2.54,3.073; 14 -3.81,3.073
PLCC-S32 = drill 0.813: 1 1.27,5.08 | drill 0.813 octagon: 2 -1.27,7.62; 3 -1.27,5.08; 4 -3.81,7.62; 5 -6.35,5.08; 6 -3.81,5.08; 7 -6.35,2.54; 8 -3.81,2.54; 9 -6.35,0; 10 -3.81,0; 11 -6.35,-2.54; 12 -3.81,-2.54; 13 -6.35,-5.08; 14 -3.81,-7.62; 15 -3.81,-5.08; 16 -1.27,-7.62; 17 -1.27,-5.08; 18 1.27,-7.62; 19 1.27,-5.08; 20 3.81,-7.62; 21 6.35,-5.08; 22 3.81,-5.08; 23 6.35,-2.54; 24 3.81,-2.54; 25 6.35,0; 26 3.81,0; 27 6.35,2.54; 28 3.81,2.54; 29 6.35,5.08; 30 3.81,7.62; 31 3.81,5.08; 32 1.27,7.62
PLCC-S44 = drill 0.813: 1 1.27,6.35 | drill 0.813 octagon: 2 -1.27,8.89; 3 -1.27,6.35; 4 -3.81,8.89; 5 -3.81,6.35; 6 -6.35,8.89; 7 -8.89,6.35; 8 -6.35,6.35; 9 -8.89,3.81; 10 -6.35,3.81; 11 -8.89,1.27; 12 -6.35,1.27; 13 -8.89,-1.27; 14 -6.35,-1.27; 15 -8.89,-3.81; 16 -6.35,-3.81; 17 -8.89,-6.35; 18 -6.35,-8.89; 19 -6.35,-6.35; 20 -3.81,-8.89; 21 -3.81,-6.35; 22 -1.27,-8.89; 23 -1.27,-6.35; 24 1.27,-8.89; 25 1.27,-6.35; 26 3.81,-8.89; 27 3.81,-6.35; 28 6.35,-8.89; 29 8.89,-6.35; 30 6.35,-6.35; 31 8.89,-3.81; 32 6.35,-3.81; 33 8.89,-1.27; 34 6.35,-1.27; 35 8.89,1.27; 36 6.35,1.27; 37 8.89,3.81; 38 6.35,3.81; 39 8.89,6.35; 40 6.35,8.89; 41 6.35,6.35; 42 3.81,8.89; 43 3.81,6.35; 44 1.27,8.89
DIP28 = drill 0.813 pad 1.626: 1 -16.51,-3.81; 2 -13.97,-3.81; 3 -11.43,-3.81; 4 -8.89,-3.81; 5 -6.35,-3.81; 6 -3.81,-3.81; 7 -1.27,-3.81; 8 1.27,-3.81; 9 3.81,-3.81; 10 6.35,-3.81; 11 8.89,-3.81; 12 11.43,-3.81; 13 13.97,-3.81; 14 16.51,-3.81; 15 16.51,3.81; 16 13.97,3.81; 17 11.43,3.81; 18 8.89,3.81; 19 6.35,3.81; 20 3.81,3.81; 21 1.27,3.81; 22 -1.27,3.81; 23 -3.81,3.81; 24 -6.35,3.81; 25 -8.89,3.81; 26 -11.43,3.81; 27 -13.97,3.81; 28 -16.51,3.81
CHIPLED_1206 = smd 1.5 x 1.5: A 0,-1.75; C 0,1.75
DIL08S = drill 0.813: 1 -3.81,-3.81; 4 3.81,-3.81; 5 3.81,3.81; 8 -3.81,3.81
R2012 = smd 1.3 x 1.5: 1 -0.85,0; 2 0.85,0
DP-04 = drill 0.813 long: 1 -3.81,-3.81; 2 -1.27,-3.81; 3 1.27,-3.81; 4 3.81,-3.81; 5 3.81,3.81; 6 1.27,3.81; 7 -1.27,3.81; 8 -3.81,3.81
ML6 = drill 0.914 octagon: 1 -2.54,-1.27; 2 -2.54,1.27; 3 0,-1.27; 4 0,1.27; 5 2.54,-1.27; 6 2.54,1.27
ML64L = drill 0.914 pad 1.6 octagon: 1 -39.37,-1.27; 2 -39.37,1.27; 3 -36.83,-1.27; 4 -36.83,1.27; 5 -34.29,-1.27; 6 -34.29,1.27; 7 -31.75,-1.27; 8 -31.75,1.27; 9 -29.21,-1.27; 10 -29.21,1.27; 11 -26.67,-1.27; 12 -26.67,1.27; 13 -24.13,-1.27; 14 -24.13,1.27; 15 -21.59,-1.27; 16 -21.59,1.27; 17 -19.05,-1.27; 18 -19.05,1.27; 19 -16.51,-1.27; 20 -16.51,1.27; 21 -13.97,-1.27; 22 -13.97,1.27; 23 -11.43,-1.27; 24 -11.43,1.27; 25 -8.89,-1.27; 26 -8.89,1.27; 27 -6.35,-1.27; 28 -6.35,1.27; 29 -3.81,-1.27; 30 -3.81,1.27; 31 -1.27,-1.27; 32 -1.27,1.27; 33 1.27,-1.27; 34 1.27,1.27; 35 3.81,-1.27; 36 3.81,1.27; 37 6.35,-1.27; 38 6.35,1.27; 39 8.89,-1.27; 40 8.89,1.27; 41 11.43,-1.27; 42 11.43,1.27; 43 13.97,-1.27; 44 13.97,1.27; 45 16.51,-1.27; 46 16.51,1.27; 47 19.05,-1.27; 48 19.05,1.27; 49 21.59,-1.27; 50 21.59,1.27; 51 24.13,-1.27; 52 24.13,1.27; 53 26.67,-1.27; 54 26.67,1.27; 55 29.21,-1.27; 56 29.21,1.27; 57 31.75,-1.27; 58 31.75,1.27; 59 34.29,-1.27; 60 34.29,1.27; 61 36.83,-1.27; 62 36.83,1.27; 63 39.37,-1.27; 64 39.37,1.27

### Placement (x,y rotation side)
C1  -22,72.5 0 top  (outside the outline)
C2  -15,72.5 0 top  (outside the outline)
C3  -9,72.5 0 top  (outside the outline)
C4  165.5,55.5 0 top  (outside the outline)
C5  166,62.5 0 top  (outside the outline)
C6  165.5,50 0 top  (outside the outline)
C7  177.5,30 0 top  (outside the outline)
C8  177.5,36 0 top  (outside the outline)
C9  176.5,40.5 0 top  (outside the outline)
C10  177,45 0 top  (outside the outline)
C101  15,94 90 bottom
C102  12.5,94 90 bottom
C104  5.5,87.5 180 top
C105  18,94.5 90 bottom
C106  80.5,72 0 top
C107  85.5,80 180 top
C108  62.5,77 90 top
C109  40,72 0 top
C110  60.5,72 0 top
C111  22,77 90 top
C113  142.5,76 0 top
C114  143,79 0 top
C115  117,97 0 top
C116  16.5,70 270 top
C117  -11,19.5 0 top  (outside the outline)
C201  -8.5,0 0 top  (outside the outline)
C202  -9,7 0 top  (outside the outline)
H101  4,96 0 top
H102  4,4 0 top
H103  156,96 0 top
H104  156,4 0 top
IC101  71.5,77 180 top
IC102  94,77 0 top
IC103  31,77 180 top
IC104  51.5,77 180 top
IC105  -10.5,27 0 top  (outside the outline)
IC106  123,80 180 top
IC107  12.5,77 180 top
IC201  46.5,55 0 top
IC301  -16.5,51.5 0 top  (outside the outline)
IC501  167.5,83 90 top  (outside the outline)
IC502  165.5,25 270 top
LED101  3.5,78 0 top
QG101  -10.5,88.5 0 top  (outside the outline)
R101  102,81.5 270 top
R102  104.5,81.5 270 top
R103  3.5,73 90 top
R104  85.5,82.5 180 top
R105  100.5,90.5 90 top
R303  -17.5,17 0 top  (outside the outline)
S1  108.5,93.5 180 top
SV1  176,56.5 90 top  (outside the outline)
SV101  53.34,88.9 0 top

### Tracks (layer width: path | path; a pad name or v marks a point on that pad's centre or on a via)
!68681_IRQ  (1 unrouted)
!AS
  Bottom 0.203: SV101.13 29.34,87.5 30,87.5 30.5,88 30.5,91.5 31,92 61,92 62.65,93.65 93.58,93.65 95.23,92 110,92 111,91 111,86 111.57,85.43 IC106.11
!AVR_RESET  (1 unrouted)
!CS  (via drill 0.35)  (1 unrouted)
  Top 0.203: IC103.19 35.45,74.94 v35.5,75 | IC101.19 75.94,74.94 v76,75 76,76 78.2,78.2 110.56,78.2 111.57,77.19 IC106.14 | IC104.19 55.95,74.94 v56,75 | v16.5,75.5 16.31,75.69 IC107.1
  Bottom 0.203: v76,75 v56,75 v35.5,75 17,75 v16.5,75.5
!DTACK  (1 unrouted)
  Bottom 0.203: SV101.10 27.29,93.33 60.36,93.33 62.02,94.99 64.99,94.99 65,95 93.5,95 93.51,94.99 93.64,94.99 95.64,92.99 110.41,92.99 111.57,91.83 113.14,91.83 118,86.97 118,77 117.19,76.19 IC106.16
!DUART_CS  (1 unrouted)
!EXT_ID  (via drill 0.35)
  Top 0.203: v66,96.5 66,88 65.63,87.63 SV101.41
  Bottom 0.203: v66,96.5 66.18,96.32 94.18,96.32 96.19,94.31 110.96,94.31 112.12,93.15 113.75,93.15 120.4,86.5 123,86.5 124.27,85.23 IC106.6
!EXTI_A  (via drill 0.35)
  Top 0.203: SV101.16 31.75,94.25 v32,94.5
  Bottom 0.203: v32,94.5 32.5,94 60.1,94 61.76,95.66 93.91,95.66 95.92,93.65 110.68,93.65 111.84,92.49 113.48,92.49 120.5,85.47 120.5,77 119.69,76.19 IC106.17
!LDS
  Bottom 0.203: SV101.11 27.63,87.63 28,88 28,91 29.66,92.66 60.73,92.66 62.4,94.33 93.37,94.33 95.37,92.33 110.14,92.33 111.33,91.14 111.33,86.59 IC106.10
!PS2_CS  (1 unrouted)
!RD  (2 unrouted)
  Top 0.203: IC101.1 77.22,79.28 77.97,78.53 112.97,78.53 114.11,77.39 IC106.15
!RESET  (1 unrouted)
  Bottom 0.203: SV101.6 20.38,91.5 24.99,91.5 27.15,93.66 60.23,93.66 61.89,95.32 64.85,95.32 64.86,95.33 93.77,95.33 95.78,93.32 110.55,93.32 111.71,92.16 113.27,92.16 114.43,91 114.5,91 119.19,86.31 IC106.8
!ROM_CS  (2 unrouted)
+5V  (via drill 0.35)  (27 unrouted)
  Top 0.203: IC104.20 57.22,72 v57.22,74 IC104.1 | v36.72,74 IC103.1 | R103.1 3.35,72 v2,72 | IC107.13 IC107.14 | IC107.14 16.38,74 | IC107.14 16.5,73.74 | S1.4 S1.3 S1.2 S1.1 115.74,97.31 C115.1 | IC102.3 92.09,75.41 91.5,76 90,76 89.5,75.5 89.5,73.98 IC102.1 85.57,73.93 v85.5,74
  Top 0.406: v77.5,74 77.22,73.72 IC101.20 79.52,71.97 C106.1 | C110.1 57.22,72 | IC104.20 v57.22,74 | v36.72,74 IC103.20 36.74,72 C109.1 | 16.38,74 v17.5,74 | C107.1 86.52,80.07 v88.5,80.07 IC102.16 | C114.+ 141.55,78.95 C113.1 141.36,76.19 IC106.24
  Top 0.61: C111.+ v22,74 | C108.+ v62.5,74
  Bottom 0.406: v88.5,80.07 88.5,77 v85.5,74 v77.5,74
  Bottom 0.61: v77.5,74 v62.5,74 v57.22,74 v36.72,74 v22,74 v17.5,74 2,74
  Bottom 0.813: v2,72 2,74 2,82.73 C104.+ 6.9,87.63 SV101.1 SV101.2 13.97,93.02 14,93.05 | C105.+ 15.05,93 C101.1 14,93.05 | 14,93.05 C102.1
A1
  Top 0.203: SV101.20 36.83,90.83 37.5,91.5 40,91.5 40.5,91 40.5,87 39,85.5 36,85.5 35.45,84.94 IC103.2
A2
  Top 0.203: SV101.22 38,88.8 38,87 37,86 35.67,86 34.17,84.51 IC103.3
A3
  Top 0.203: SV101.19 32.91,83.7 IC103.4
A4  (via drill 0.35)
  Top 0.203: v32,85 31.64,84.64 IC103.5
  Bottom 0.203: v32,85 40.81,85 43,87.19 43,89.5 42.33,90.17 SV101.24
A5  (via drill 0.35)
  Top 0.203: v30.5,86 30.5,82.66 IC103.6
  Bottom 0.203: v30.5,86 30.67,85.83 38.33,85.83 39.37,86.87 SV101.21
A6  (via drill 0.35)
  Top 0.203: v29.5,85.5 29,85 29,82.62 IC103.7
  Bottom 0.203: SV101.23 41.92,87.62 41.92,86.58 40.85,85.5 v29.5,85.5
A7  (via drill 0.35)
  Top 0.203: v28,84.5 28,82.7 IC103.8
  Bottom 0.203: v28,84.5 40.78,84.5 43.42,87.14 43.42,89.92 43.67,90.17 SV101.26
A8  (via drill 0.35)
  Top 0.203: v27,84 26.55,83.56 IC103.9 | SV101.25 45.5,88.68 v45.5,94.5
  Bottom 0.203: SV101.25 40.82,84 v27,84 | v45.5,94.5 45.67,94.33 59.96,94.33 61.62,95.99 94.04,95.99 96.05,93.98 110.82,93.98 111.98,92.82 113.61,92.82 121.73,84.7 IC106.7
A9  (via drill 0.35)
  Top 0.203: v56,85 55.95,84.94 IC104.2 | v47,94.82 SV101.28
  Bottom 0.203: SV101.28 48.16,89 50,89 50.67,88.33 50.67,85.83 51.5,85 v56,85 | IC106.4 129.35,85.15 127.67,86.83 120.54,86.83 113.89,93.48 112.52,93.48 112.5,93.5 112.24,93.5 111.09,94.64 96.33,94.64 94.32,96.65 66.54,96.65 66.2,96.99 62.16,96.99 59.83,94.66 47.16,94.66 v47,94.82
A10  (via drill 0.35)
  Top 0.203: v54.5,84 54.67,83.83 IC104.3
  Bottom 0.203: SV101.27 50.62,84 v54.5,84
A11  (via drill 0.35)
  Top 0.203: v53,85.5 53.41,85.09 IC104.4
  Bottom 0.203: SV101.30 51,88.7 51,86 51.5,85.5 v53,85.5
A12  (via drill 0.35)
  Top 0.203: v52,84.5 52,82.16 IC104.5
  Bottom 0.203: SV101.29 49.53,86.47 51.5,84.5 v52,84.5
A13
  Top 0.203: IC104.6 50.87,85.36 52.07,86.57 SV101.31
A14
  Top 0.203: IC104.7 49.59,83.59 50.53,84.53 50.53,85.5 51,85.97 51,89.5 51.67,90.17 SV101.32
A15
  Top 0.203: SV101.33 54.61,86.61 54,86 54,80.5 53.5,80 49,80 48.33,80.67 IC104.8
A16
  Top 0.203: SV101.34 55.33,90.17 56,89.5 56,86.5 55.23,85.73 55.23,80.73 54.17,79.67 47.83,79.67 47.05,80.44 IC104.9
A17
  Top 0.203: IC107.3 13.77,83.23 12,85 12,93 14.5,95.5 55.5,95.5 57.15,93.85 SV101.36
A18
  Top 0.203: SV101.35 57.63,87.63 58.5,88.5 58.5,93 55.67,95.83 14.36,95.83 11.67,93.14 11.67,84.86 12.5,84.03 IC107.4
A19
  Top 0.203: IC107.5 11.34,80.18 11.34,93.27 14.23,96.16 55.84,96.16 59.69,92.31 SV101.38
A20  (via drill 0.35)
  Top 0.203: IC102.10 97.17,81.83 v97,82
  Bottom 0.203: SV101.37 60.63,87.63 61,88 61,91 62.99,92.99 93.77,92.99 97,89.76 v97,82
A21  (via drill 0.35)
  Top 0.203: IC102.12 94.5,80.21 v94.5,82
  Bottom 0.203: SV101.40 63.17,91.11 63.17,91.14 64.69,92.66 93.64,92.66 94.5,91.8 v94.5,82
A22  (via drill 0.35)
  Top 0.203: IC102.13 93.5,80.21 v93.5,82
  Bottom 0.203: SV101.39 62.36,87.5 63,87.5 63.5,88 63.5,91 64.83,92.33 93.5,92.33 94,91.83 94,87 93.5,86.5 v93.5,82
A23  (via drill 0.35)
  Top 0.203: IC102.15 90.83,81.83 v91,82
  Bottom 0.203: SV101.42 64.77,91.27 65.5,92 91,92 91.5,91.5 91.5,82.5 v91,82
ADDR_MATCH
  Top 0.203: IC102.6 95.91,75.41 96.69,76.19 IC106.13
ADDR_SET0
  Top 0.203: IC102.9 98.44,83.94 99.34,84.84 104,84.84 104.27,84.84 | S1.8 112.31,88.31 111.67,87.67 107.1,87.67 104.27,84.84 | 104.27,84.84 104.5,84.84 R102.1
ADDR_SET1  (via drill 0.35)
  Top 0.203: IC102.11 95.91,84.91 96.17,85.17 98,85.17 | 98,85.17 104.14,85.17 106.97,88 109,88 109.77,88.77 S1.7 | R101.1 101.85,82.5 v100.5,82.5 | v98,84.5 98,85.17
  Bottom 0.203: v100.5,82.5 100,82.5 v98,84.5
ADDR_SET2
  Top 0.203: S1.6 107.23,88.73 104,85.5 96,85.5 93.5,83 | IC102.14 92.09,81.59 93.5,83 | R104.1 86.85,83 93.5,83
ADDR_SET3
  Top 0.203: IC106.5 126.81,85.19 125.5,86.5 118.5,86.5 113.5,91.5 105,91.5 104.69,91.19 S1.5 100.54,89.69 R105.1
AVR_MISO  (1 unrouted)
AVR_MOSI  (1 unrouted)
AVR_SCK  (1 unrouted)
BOARD_A0  (2 unrouted)
BOARD_A1  (2 unrouted)
BOARD_A2  (2 unrouted)
BOARD_A3  (2 unrouted)
BOARD_A4  (1 unrouted)
BOARD_A5  (1 unrouted)
BOARD_A6  (1 unrouted)
BOARD_A7  (1 unrouted)
BOARD_A8  (1 unrouted)
BOARD_A9  (1 unrouted)
BOARD_A10  (1 unrouted)
BOARD_A11  (1 unrouted)
BOARD_A12  (1 unrouted)
BOARD_A13  (1 unrouted)
BOARD_A14  (2 unrouted)
BOARD_A15  (2 unrouted)
BOARD_A16  (1 unrouted)
BOARD_D0  (1 unrouted)
BOARD_D1  (1 unrouted)
BOARD_D2  (1 unrouted)
BOARD_D3  (1 unrouted)
BOARD_D4  (1 unrouted)
BOARD_D5  (1 unrouted)
BOARD_D6  (1 unrouted)
BOARD_D7  (1 unrouted)
D0  (via drill 0.35)
  Top 0.203: v76,83.5 76,82.08 IC101.2
  Bottom 0.203: SV101.62 89.17,90.17 88,89 87,89 86.5,88.5 86.5,87 86,86.5 80.97,86.5 78.47,84 76.5,84 v76,83.5
D1  (via drill 0.35)
  Top 0.203: v74.5,83.5 74.5,82.2 IC101.3
  Bottom 0.203: SV101.60 86.67,90.17 85.17,88.67 81.67,88.67 81.04,88.04 81.04,87.04 78.34,84.34 75.84,84.34 75,83.5 v74.5,83.5
D2  (via drill 0.35)
  Top 0.203: v73,83.5 73.41,83.09 IC101.4
  Bottom 0.203: SV101.58 84.17,90.17 83.5,89.5 83.5,89 81,89 80.67,88.67 79.17,88.67 78.83,88.33 78.83,86.36 77.14,84.67 74.67,84.67 73.5,83.5 v73,83.5
D3  (via drill 0.35)
  Top 0.203: v72,83.5 72.14,83.36 IC101.5
  Bottom 0.203: SV101.56 81.67,90.17 80.5,89 79,89 78.5,88.5 78.5,86.5 77,85 74.5,85 73.5,84 72.5,84 v72,83.5
D4  (via drill 0.35)
  Top 0.203: v71,83.5 71,82.16 IC101.6
  Bottom 0.203: SV101.54 79.17,90.17 78,89 77,89 76.44,88.44 76.44,85.77 76,85.33 74.36,85.33 73.36,84.33 71.83,84.33 v71,83.5
D5  (via drill 0.35)
  Top 0.203: v70,83.5 69.59,83.09 IC101.7
  Bottom 0.203: SV101.52 76.67,90.17 76.11,89.61 76.11,85.91 75.86,85.66 74.23,85.66 73.23,84.66 71.16,84.66 v70,83.5
D6  (via drill 0.35)
  Top 0.203: IC101.8 68.33,83.33 v68.5,83.5
  Bottom 0.203: SV101.50 74.17,90.17 73.5,89.5 73.5,85.5 73,85 70,85 v68.5,83.5
D7  (via drill 0.35)
  Top 0.203: v67,83.5 67.06,83.44 IC101.9
  Bottom 0.203: SV101.48 71.67,90.17 71,89.5 71,85.83 70.5,85.33 68.83,85.33 v67,83.5
GND  (via drill 0.35)  (21 unrouted)
  other vias: 1,1 1,11 1,13.5 1,8.5 1,16 1,18.5 1,21 1,23.5 1,26 1,71 1,73.5 1,68.5 1,76 1,78.5 1,81 1,83.5 1,86 1,51 1,53.5 1,48.5 1,56 1,58.5 1,61 1,63.5 1,66 1,31 1,33.5 1,28.5 1,36 1,38.5 1,41 1,43.5 1,46 1,88.5 1,91 1,93.5 1,99 143.5,99 141,99 146,99 138.5,99 136,99 133.5,99 131,99 128.5,99 123.5,99 121,99 126,99 118.5,99 116,99 113.5,99 111,99 108.5,99 103.5,99 101,99 106,99 98.5,99 96,99 93.5,99 91,99 88.5,99 83.5,99 81,99 86,99 78.5,99 76,99 73.5,99 71,99 68.5,99 63.5,99 61,99 66,99 58.5,99 56,99 53.5,99 51,99 48.5,99 43.5,99 41,99 46,99 38.5,99 36,99 33.5,99 31,99 28.5,99 23.5,99 21,99 26,99 18.5,99 16,99 13.5,99 11,99 8.5,99 159,99 151,99 148.5,99 8.5,1 159,93.5 159,11 159,13.5 159,8.5 159,16 159,18.5 159,21 159,23.5 159,26 159,31 159,28.5 159,71 159,73.5 159,68.5 159,76 159,78.5 159,81 159,83.5 159,86 159,91 159,88.5 159,63.5 159,66 159,41 159,43.5 159,38.5 159,46 159,48.5 159,51 159,53.5 159,56 159,61 159,58.5 159,33.5 159,36 159,1 151,1 148.5,1 146,1 143.5,1 141,1 138.5,1 136,1 131,1 133.5,1 121,1 118.5,1 123.5,1 116,1 113.5,1 111,1 108.5,1 106,1 101,1 103.5,1 128.5,1 126,1 91,1 88.5,1 93.5,1 86,1 83.5,1 81,1 78.5,1 76,1 71,1 73.5,1 98.5,1 96,1 61,1 58.5,1 63.5,1 56,1 53.5,1 51,1 48.5,1 46,1 41,1 43.5,1 68.5,1 66,1 31,1 28.5,1 33.5,1 26,1 23.5,1 21,1 18.5,1 16,1 11,1 13.5,1 38.5,1 36,1
  pour Bottom: 0,0 0,100 160,100 160,0
  pour Top: 0,0 0,100 160,100 160,0
N$18
  Top 0.203: LED101.A R103.2
PS2_UART_RX  (1 unrouted)
PS2_UART_TX  (1 unrouted)
R/!W!  (2 unrouted)
  Bottom 0.203: SV101.12 29.5,93 60.5,93 62.16,94.66 93.5,94.66 95.5,92.66 110.27,92.66 111.43,91.5 113,91.5 116.65,87.85 IC106.9
SLOT_D0  (1 unrouted)
SLOT_D1  (1 unrouted)
SLOT_D2  (1 unrouted)
SLOT_D3  (1 unrouted)
SLOT_D4  (1 unrouted)
SLOT_D5  (1 unrouted)
SLOT_D6  (1 unrouted)
SLOT_D7  (1 unrouted)
UART_CLK  (2 unrouted)

### Text on the board
tNames: 0-2: Base Address ($8-$D) / 3: IRQ enable | Configuration | 68komputer Multi IO Board | 2019 Tristan Seifert | Rev 01